# EAGLE design Prism (EAGLE 9.2.1)

## Sheet 1 of 3
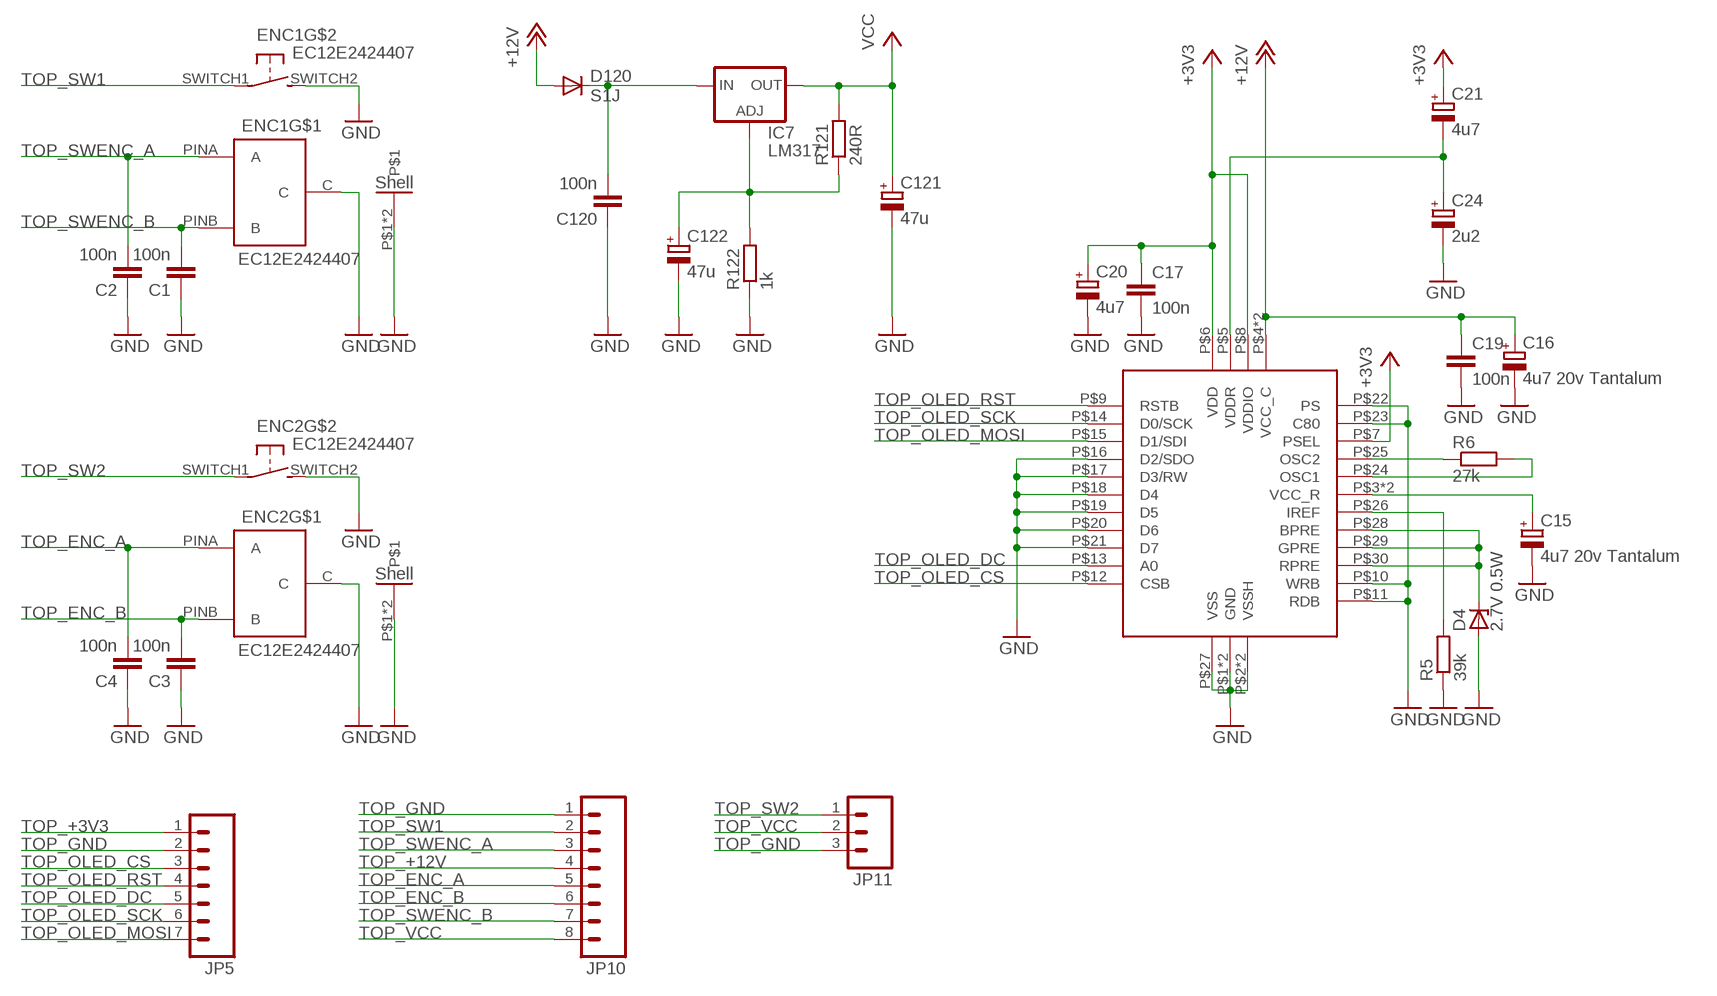
[diagram p0: schematic, sheet 1]

### Parts
C1  100n  C-EUC0603  [C0603]
C2  100n  C-EUC0603  [C0603]
C3  100n  C-EUC0603  [C0603]
C4  100n  C-EUC0603  [C0603]
C15  4u7 20v Tantalum  CPOL-EUCT3216  [CT3216]
C16  4u7 20v Tantalum  CPOL-EUCT3216  [CT3216]
C17  100n  C-EUC0603  [C0603]
C19  100n  C-EUC0603  [C0603]
C20  4u7  CPOL-EU153CLV-0405  [153CLV-0405]
C21  4u7  CPOL-EU153CLV-0405  [153CLV-0405]
C24  2u2  CPOL-EU153CLV-0405  [153CLV-0405]
C120  100n  C-EUC0603  [C0603]
C121  47u  CPOL-EU153CLV-0505  [CPOL-5]
C122  47u  CPOL-EU153CLV-0505  [CPOL-5]
D4  2.7V 0.5W  ZENER-DIODESOD80C  [SOD80C]
D120  S1J  DIODESMA  [SMA-DIODE]
ENC1  EC12E2424407  [EC12E2424407]
ENC2  EC12E2424407  [EC12E2424407]
IC7  LM317  LM317MDT  [DPACK]
JP5  M07  [1X07]
JP10  M081X08  [1X08]
JP11  M03PTH  [1X03]
R5  39k  R-EU_0603  [0603]
R6  27k  R-EU_0603  [0603]
R121  240R  R-EU_0603  [0603]
R122  1k  R-EU_0603  [0603]
U$1  MCOT096096AY  [MCOT096096AY]

### Nets
N$3: C120.2 D120.C IC7.3(IN)
N$9: C15.+ U$1.P$3(VCC_R) U$1.P$32(VCC_R)
N$16: C122.+ IC7.1(ADJ) R121.1 R122.2
N$23: C21.- C24.+ U$1.P$5(VDDR)
N$29: D4.C U$1.P$28(BPRE) U$1.P$29(GPRE) U$1.P$30(RPRE)
N$30: R6.1 U$1.P$25(OSC2)
N$31: R6.2 U$1.P$24(OSC1)
N$32: R5.2 U$1.P$26(IREF)
TOP_+3V3: C17.1 C20.+ C21.+ JP5.1 U$1.P$6(VDD) U$1.P$7(PSEL) U$1.P$8(VDDIO) ; supply symbol labelled +3V3
TOP_+12V: C16.+ C19.1 D120.A JP10.4 U$1.P$4(VCC_C) U$1.P$31(VCC_C) ; supply symbol labelled +12V
TOP_ENC_A: C4.2 ENC2.PINA(A) JP10.5
TOP_ENC_B: C3.2 ENC2.PINB(B) JP10.6
TOP_GND: C1.1 C2.1 C3.1 C4.1 C15.- C16.- C17.2 C19.2 C20.- C24.- C120.1 C121.- C122.- D4.A ENC1.C ENC1.P$1 ENC1.P$2 ENC1.SWITCH2(S) ENC2.C ENC2.P$1 ENC2.P$2 ENC2.SWITCH2(S) JP5.2 JP10.1 JP11.3 R5.1 R122.1 U$1.P$1(GND) U$1.P$2(VSSH) U$1.P$10(WRB) U$1.P$11(RDB) U$1.P$16(D2/SDO) U$1.P$17(D3/RW) U$1.P$18(D4) U$1.P$19(D5) U$1.P$20(D6) U$1.P$21(D7) U$1.P$22(PS) U$1.P$23(C80) U$1.P$27(VSS) U$1.P$33(VSSH) U$1.P$34(GND) ; supply symbol labelled GND
TOP_OLED_CS: JP5.3 U$1.P$12(CSB)
TOP_OLED_DC: JP5.5 U$1.P$13(A0)
TOP_OLED_MOSI: JP5.7 U$1.P$15(D1/SDI)
TOP_OLED_RST: JP5.4 U$1.P$9(RSTB)
TOP_OLED_SCK: JP5.6 U$1.P$14(D0/SCK)
TOP_SW1: ENC1.SWITCH1(P) JP10.2
TOP_SW2: ENC2.SWITCH1(P) JP11.1
TOP_SWENC_A: C2.2 ENC1.PINA(A) JP10.3
TOP_SWENC_B: C1.2 ENC1.PINB(B) JP10.7
TOP_VCC: C121.+ IC7.4(OUT) JP10.8 JP11.2 R121.2 ; supply symbol labelled VCC

## Sheet 2 of 3
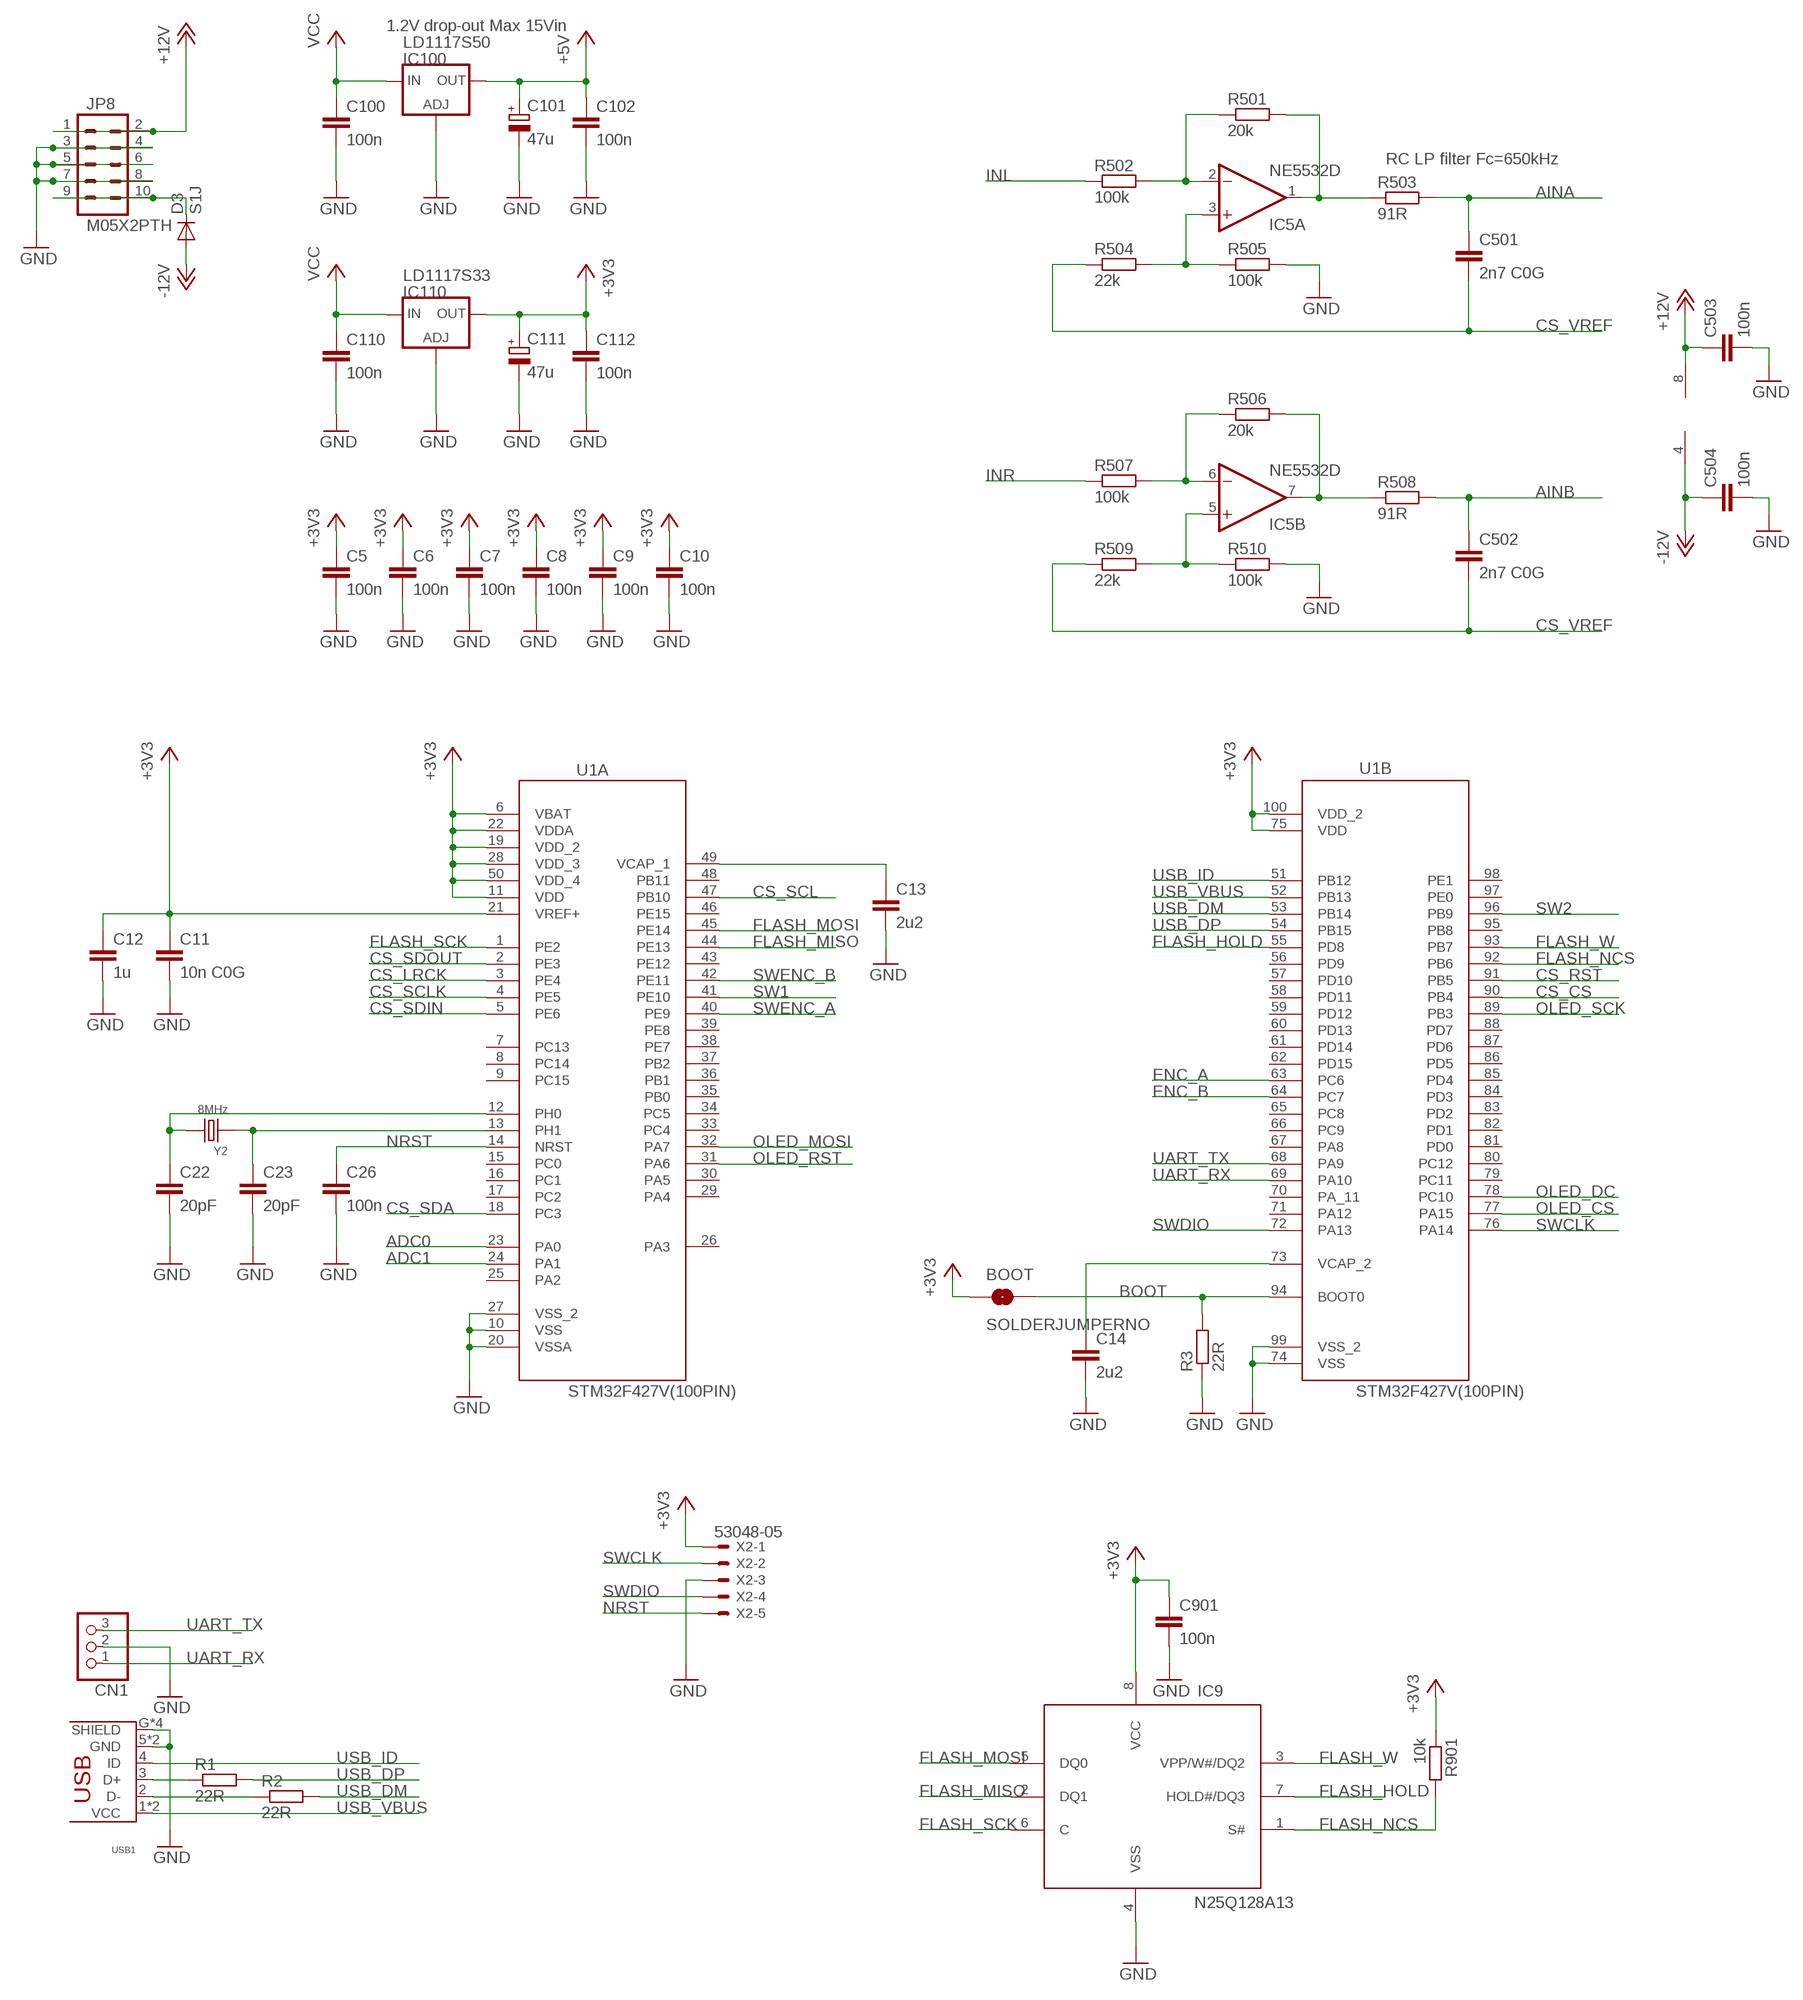
[diagram p1: schematic, sheet 2, part 1 of 2]
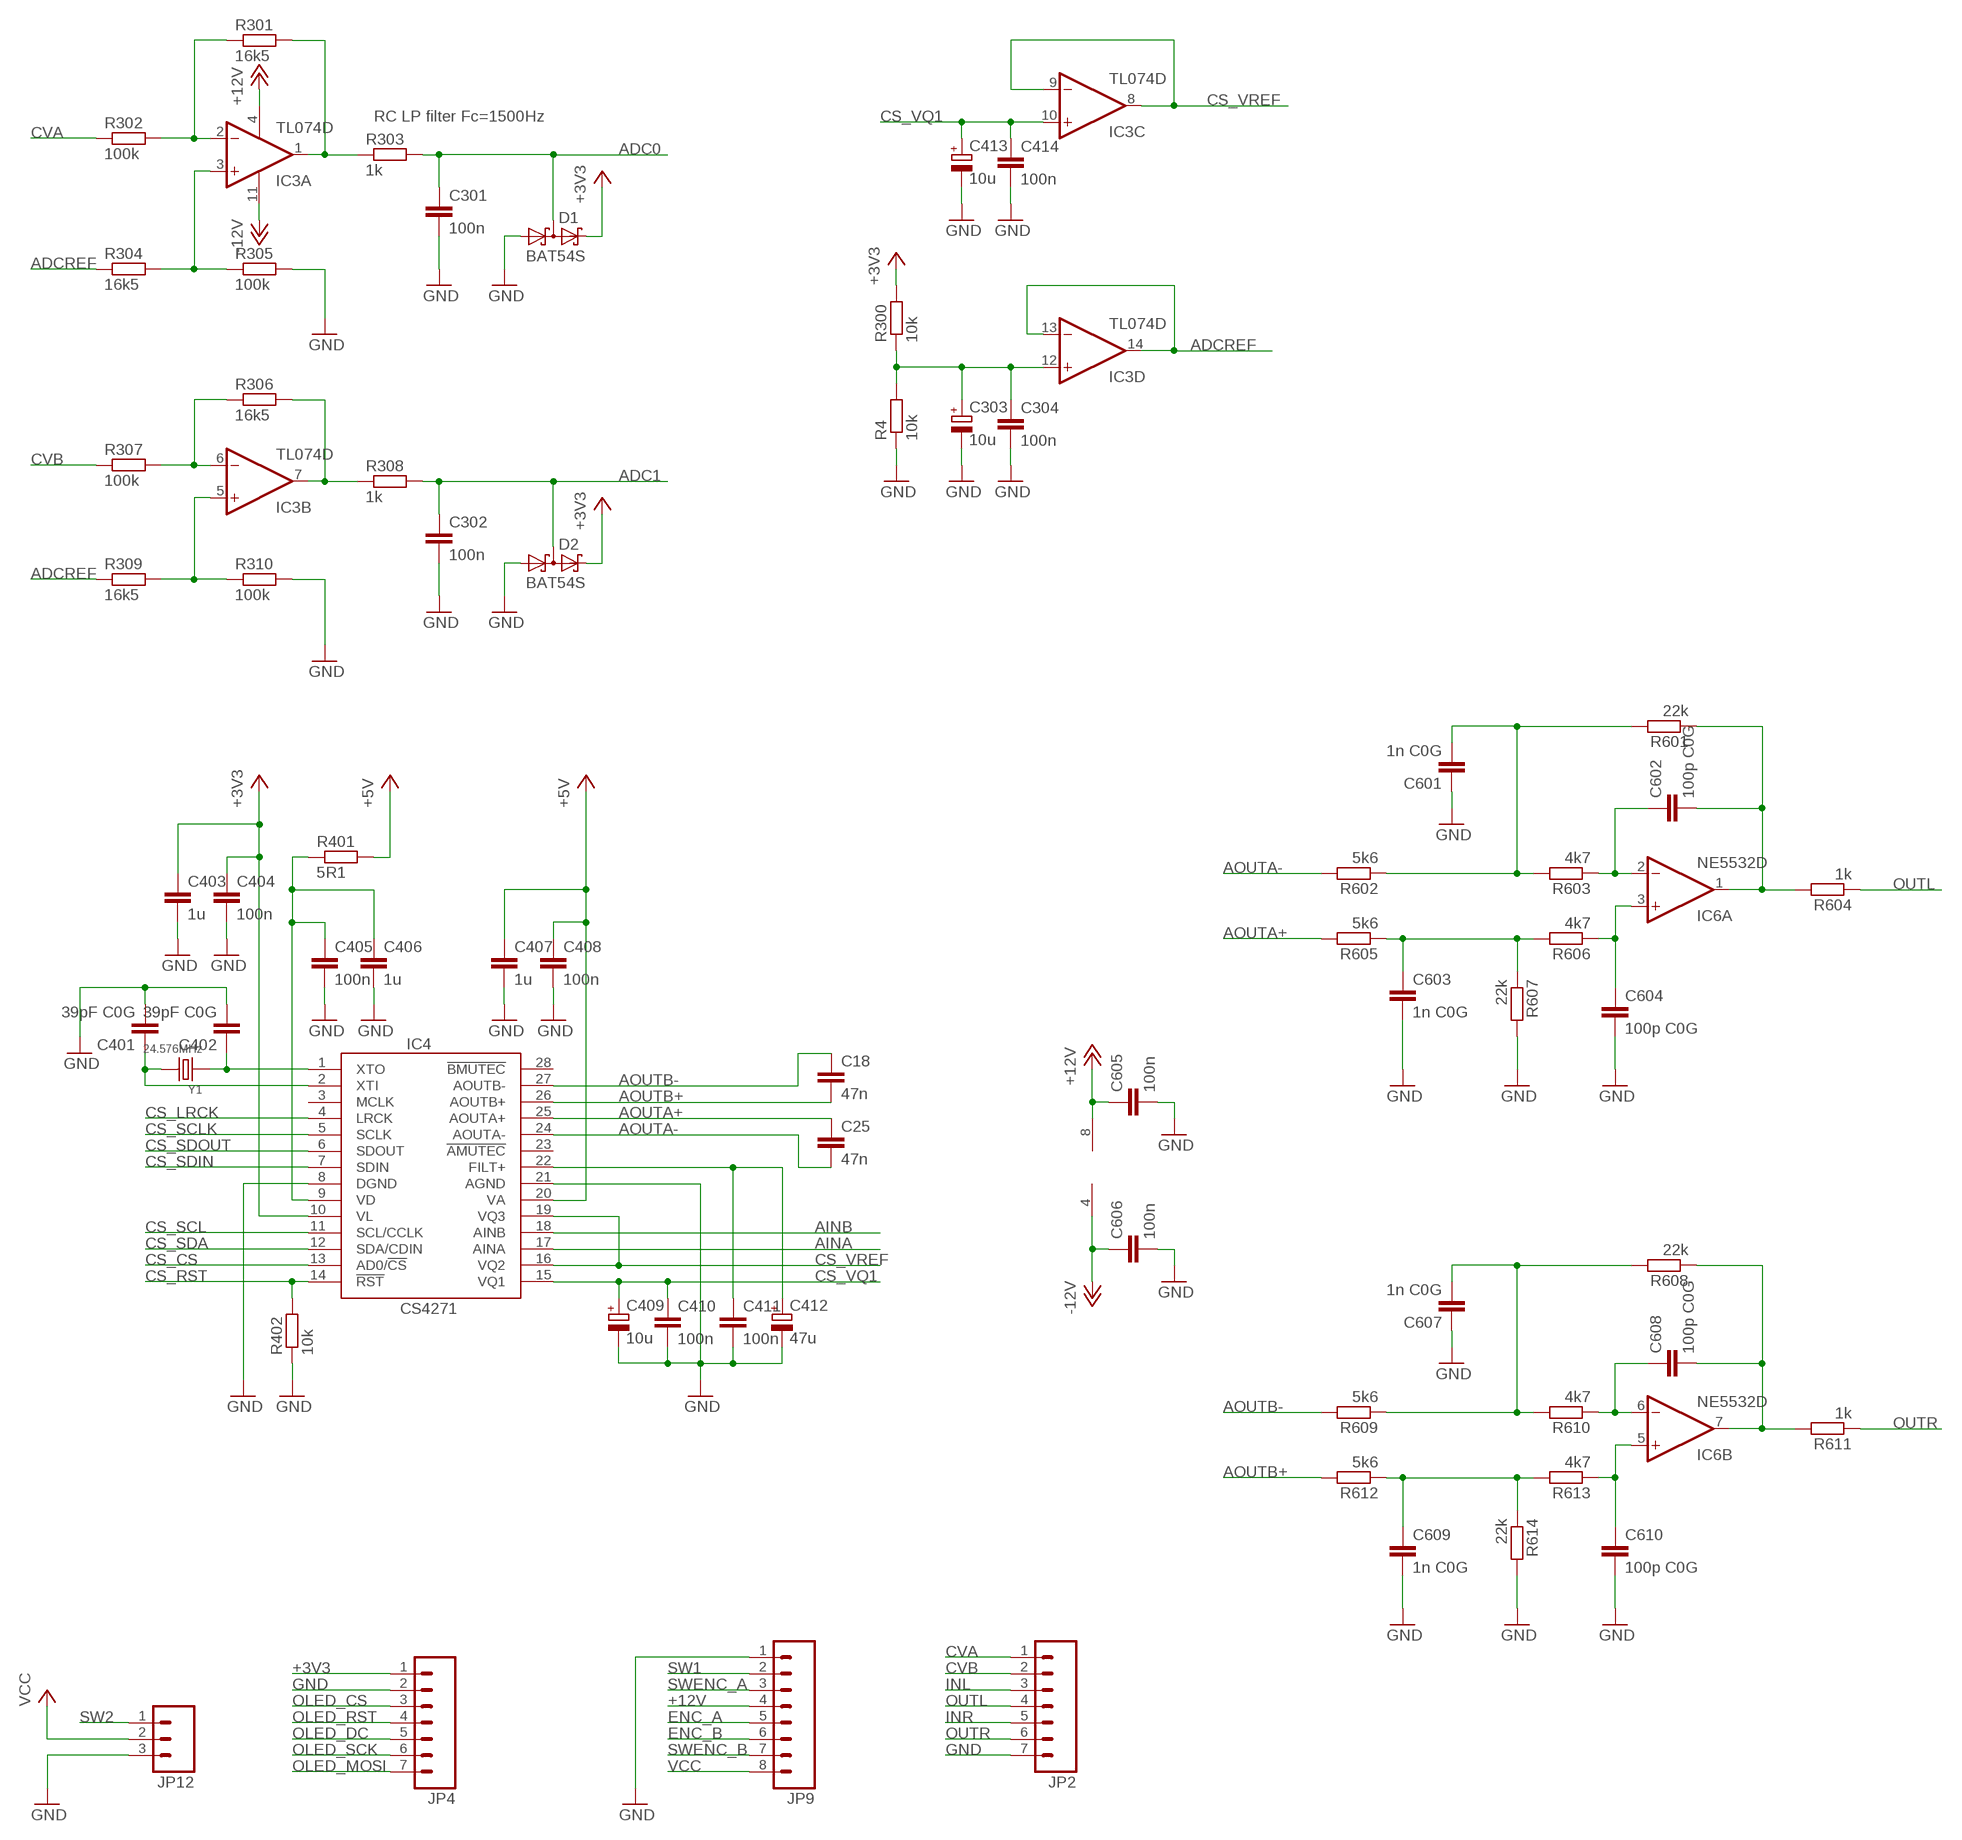
[diagram p2: schematic, sheet 2, part 2 of 2]

### Parts
BOOT  SOLDERJUMPERNO  [SJ_2S-NO]
C5  100n  C-EUC0603  [C0603]
C6  100n  C-EUC0603  [C0603]
C7  100n  C-EUC0603  [C0603]
C8  100n  C-EUC0603  [C0603]
C9  100n  C-EUC0603  [C0603]
C10  100n  C-EUC0603  [C0603]
C11  10n C0G  C-EUC0603  [C0603]
C12  1u  C-EUC0603  [C0603]
C13  2u2  C-EUC0603  [C0603]
C14  2u2  C-EUC0603  [C0603]
C18  47n  C-EUC0603  [C0603]
C22  20pF  C-EUC0603  [C0603]
C23  20pF  C-EUC0603  [C0603]
C25  47n  C-EUC0603  [C0603]
C26  100n  C-EUC0603  [C0603]
C100  100n  C-EUC0603  [C0603]
C101  47u  CPOL-EU153CLV-0505  [CPOL-5]
C102  100n  C-EUC0603  [C0603]
C110  100n  C-EUC0603  [C0603]
C111  47u  CPOL-EU153CLV-0505  [CPOL-5]
C112  100n  C-EUC0603  [C0603]
C301  100n  C-EUC0603  [C0603]
C302  100n  C-EUC0603  [C0603]
C303  10u  CPOL-EU153CLV-0505  [CPOL-5]
C304  100n  C-EUC0603  [C0603]
C401  39pF C0G  C-EUC0603  [C0603]
C402  39pF C0G  C-EUC0603  [C0603]
C403  1u  C-EUC0603  [C0603]
C404  100n  C-EUC0603  [C0603]
C405  100n  C-EUC0603  [C0603]
C406  1u  C-EUC0603  [C0603]
C407  1u  C-EUC0603  [C0603]
C408  100n  C-EUC0603  [C0603]
C409  10u  CPOL-EU153CLV-0505  [CPOL-5]
C410  100n  C-EUC0603  [C0603]
C411  100n  C-EUC0603  [C0603]
C412  47u  CPOL-EU153CLV-0505  [CPOL-5]
C413  10u  CPOL-EU153CLV-0505  [CPOL-5]
C414  100n  C-EUC0603  [C0603]
C501  2n7 C0G  C-EUC0603  [C0603]
C502  2n7 C0G  C-EUC0603  [C0603]
C503  100n  C-EUC0603  [C0603]
C504  100n  C-EUC0603  [C0603]
C601  1n C0G  C-EUC0603  [C0603]
C602  100p C0G  C-EUC0603  [C0603]
C603  1n C0G  C-EUC0603  [C0603]
C604  100p C0G  C-EUC0603  [C0603]
C605  100n  C-EUC0603  [C0603]
C606  100n  C-EUC0603  [C0603]
C607  1n C0G  C-EUC0603  [C0603]
C608  100p C0G  C-EUC0603  [C0603]
C609  1n C0G  C-EUC0603  [C0603]
C610  100p C0G  C-EUC0603  [C0603]
C901  100n  C-EUC0603  [C0603]
CN1  CON-JST-1X03PH-TH  [JST-B3B-PH-KL]
D1  BAT54S  [SOT23]
D2  BAT54S  [SOT23]
D3  S1J  DIODESMA  [SMA-DIODE]
IC3  TL074D  [SO14]
IC4  CS4271  [TSSOP28-0.65-9.7X4.4MM]
IC5  NE5532D  [SO08]
IC6  NE5532D  [SO08]
IC9  N25Q128A13  [SO8W]
IC100  LD1117S50  LD111750TRS  [SOT223]
IC110  LD1117S33  LD111750TRS  [SOT223]
JP2  M07  [1X07]
JP4  M07  [1X07]
JP8  M05X2PTH  [AVR_ICSP]
JP9  M081X08  [1X08]
JP12  M03PTH  [1X03]
R1  22R  R-EU_0603  [0603]
R2  22R  R-EU_0603  [0603]
R3  22R  R-EU_0603  [0603]
R4  10k  R-EU_0603  [0603]
R300  10k  R-EU_0603  [0603]
R301  16k5  R-EU_0603  [0603]
R302  100k  R-EU_0603  [0603]
R303  1k  R-EU_0603  [0603]
R304  16k5  R-EU_0603  [0603]
R305  100k  R-EU_0603  [0603]
R306  16k5  R-EU_0603  [0603]
R307  100k  R-EU_0603  [0603]
R308  1k  R-EU_0603  [0603]
R309  16k5  R-EU_0603  [0603]
R310  100k  R-EU_0603  [0603]
R401  5R1  R-EU_0603  [0603]
R402  10k  R-EU_0603  [0603]
R501  20k  R-EU_0603  [0603]
R502  100k  R-EU_0603  [0603]
R503  91R  R-EU_0603  [0603]
R504  22k  R-EU_0603  [0603]
R505  100k  R-EU_0603  [0603]
R506  20k  R-EU_0603  [0603]
R507  100k  R-EU_0603  [0603]
R508  91R  R-EU_0603  [0603]
R509  22k  R-EU_0603  [0603]
R510  100k  R-EU_0603  [0603]
R601  22k  R-EU_0603  [0603]
R602  5k6  R-EU_0603  [0603]
R603  4k7  R-EU_0603  [0603]
R604  1k  R-EU_0603  [0603]
R605  5k6  R-EU_0603  [0603]
R606  4k7  R-EU_0603  [0603]
R607  22k  R-EU_0603  [0603]
R608  22k  R-EU_0603  [0603]
R609  5k6  R-EU_0603  [0603]
R610  4k7  R-EU_0603  [0603]
R611  1k  R-EU_0603  [0603]
R612  5k6  R-EU_0603  [0603]
R613  4k7  R-EU_0603  [0603]
R614  22k  R-EU_0603  [0603]
R901  10k  R-EU_0603  [0603]
U1  STM32F427V(100PIN)  STM32F42XV/43XV(100PIN)  [QFP50P1600X1600X160-100N]
USB1  USB_HRS_ZX62-B-5PA(11)MICRO.B-  [HRS_ZX62D-AB-5P8_USB]
X2  53048-05  [53048-05]
Y1  24.576MHz  SMD-CRYSTAL-8MHZ-20PF-20PPM(2P-5.0X3.2MM)  [X2-SMD-5.0X3.2X1.3MM]
Y2  8MHz  SMD-CRYSTAL-8MHZ-20PF-20PPM(2P-5.0X3.2MM)  [X2-SMD-5.0X3.2X1.3MM]

### Nets
+3V3: BOOT.1 C5.1 C6.1 C7.1 C8.1 C9.1 C10.1 C11.1 C12.1 C111.+ C112.1 C403.1 C404.1 C901.1 D1.2(C2) D2.2(C2) IC4.10(VL) IC9.8(VCC) IC110.2(OUT) IC110.4(OUT) JP4.1 R300.2 R901.1 U1.6(A:VBAT) U1.11(A:VDD) U1.19(A:VDD_2) U1.21(A:VREF+) U1.22(A:VDDA) U1.28(A:VDD_3) U1.50(A:VDD_4) U1.75(B:VDD) U1.100(B:VDD_2) X2.1
+5V: C101.+ C102.1 C407.1 C408.1 IC4.20(VA) IC100.2(OUT) IC100.4(OUT) R401.2
+12V: C503.1 C605.1 IC3.4(P:V+) IC5.8(P:V+) IC6.8(P:V+) JP8.1 JP8.2 JP9.4
-12V: C504.1 C606.1 D3.A IC3.11(P:V-) IC5.4(P:V-) IC6.4(P:V-)
ADC0: C301.1 D1.3(C1A2) R303.2 U1.23(A:PA0)
ADC1: C302.1 D2.3(C1A2) R308.2 U1.24(A:PA1)
ADCREF: IC3.13(D:-IN) IC3.14(D:OUT) R304.1 R309.1
AINA: C501.1 IC4.17(AINA) R503.2
AINB: C502.1 IC4.18(AINB) R508.2
ANALOG_OUTA: C602.2 IC6.1(A:OUT) R601.1 R604.2
ANALOG_OUTB: C608.2 IC6.7(B:OUT) R608.1 R611.2
AOUTA+: C25.1 IC4.25(AOUTA+) R605.2
AOUTA-: C25.2 IC4.24(AOUTA-) R602.2
AOUTB+: C18.2 IC4.26(AOUTB+) R612.2
AOUTB-: C18.1 IC4.27(AOUTB-) R609.2
BOOT: BOOT.2 R3.2 U1.94(B:BOOT0)
CS_CS: IC4.13(AD0/!CS) U1.90(B:PB4)
CS_LRCK: IC4.4(LRCK) U1.3(A:PE4)
CS_RST: IC4.14(!RST) R402.2 U1.91(B:PB5)
CS_SCL: IC4.11(SCL/CCLK) U1.47(A:PB10)
CS_SCLK: IC4.5(SCLK) U1.4(A:PE5)
CS_SDA: IC4.12(SDA/CDIN) U1.18(A:PC3)
CS_SDIN: IC4.7(SDIN) U1.5(A:PE6)
CS_SDOUT: IC4.6(SDOUT) U1.2(A:PE3)
CS_VQ1: C409.+ C410.1 C413.+ C414.1 IC3.10(C:+IN) IC4.15(VQ1)
CS_VREF: C501.2 C502.2 IC3.8(C:OUT) IC3.9(C:-IN) IC4.16(VQ2) IC4.19(VQ3) R504.1 R509.1
CVA: JP2.1 R302.1
CVB: JP2.2 R307.1
ENC_A: JP9.5 U1.63(B:PC6)
ENC_B: JP9.6 U1.64(B:PC7)
FLASH_HOLD: IC9.7(HOLD#/DQ3) U1.55(B:PD8)
FLASH_MISO: IC9.2(DQ1) U1.44(A:PE13)
FLASH_MOSI: IC9.5(DQ0) U1.45(A:PE14)
FLASH_NCS: IC9.1(S#) R901.2 U1.92(B:PB6)
FLASH_SCK: IC9.6(C) U1.1(A:PE2)
FLASH_W: IC9.3(VPP/W#/DQ2) U1.93(B:PB7)
GND: C5.2 C6.2 C7.2 C8.2 C9.2 C10.2 C11.2 C12.2 C13.2 C14.2 C22.2 C23.2 C26.2 C100.2 C101.- C102.2 C110.2 C111.- C112.2 C301.2 C302.2 C303.- C304.2 C401.2 C402.2 C403.2 C404.2 C405.2 C406.2 C407.2 C408.2 C409.- C410.2 C411.2 C412.- C413.- C414.2 C503.2 C504.2 C601.1 C603.2 C604.2 C605.2 C606.2 C607.1 C609.2 C610.2 C901.2 CN1.2 D1.1(A1) D2.1(A1) IC4.8(DGND) IC4.21(AGND) IC9.4(VSS) IC100.1(ADJ) IC110.1(ADJ) JP2.7 JP4.2 JP8.3 JP8.4 JP8.5 JP8.6 JP8.7 JP8.8 JP9.1 JP12.3 R3.1 R4.1 R305.2 R310.2 R402.1 R505.2 R510.2 R607.2 R614.2 U1.10(A:VSS) U1.20(A:VSSA) U1.27(A:VSS_2) U1.74(B:VSS) U1.99(B:VSS_2) USB1.5(GND) USB1.7(GND) USB1.G2(SHIELD) USB1.G3(SHIELD) USB1.G4(SHIELD) USB1.G(SHIELD) X2.3
INL: JP2.3 R502.1
INR: JP2.5 R507.1
N$1: C603.1 R605.1 R606.2 R607.1
N$2: IC3.3(A:+IN) R304.2 R305.1
N$4: IC3.2(A:-IN) R301.1 R302.2
N$5: IC3.1(A:OUT) R301.2 R303.1
N$7: D3.C JP8.9 JP8.10
N$10: C601.2 R601.2 R602.1 R603.2
N$11: C13.1 U1.49(A:VCAP_1)
N$12: C23.1 U1.13(A:PH1) Y2.1
N$13: C602.1 IC6.2(A:-IN) R603.1
N$14: C604.1 IC6.3(A:+IN) R606.1
N$15: C22.1 U1.12(A:PH0) Y2.2
N$17: C14.1 U1.73(B:VCAP_2)
N$18: C402.1 IC4.1(XTO) Y1.1
N$19: R1.1 USB1.3(D+)
N$20: C411.1 C412.+ IC4.22(FILT+)
N$21: C401.1 IC4.2(XTI) Y1.2
N$22: R2.1 USB1.2(D-)
N$25: C609.1 R612.1 R613.2 R614.1
N$26: C607.2 R608.2 R609.1 R610.2
N$27: C608.1 IC6.6(B:-IN) R610.1
N$28: C610.1 IC6.5(B:+IN) R613.1
N$36: IC5.3(A:+IN) R504.2 R505.1
N$38: IC5.2(A:-IN) R501.1 R502.2
N$40: IC5.1(A:OUT) R501.2 R503.1
N$42: IC5.5(B:+IN) R509.2 R510.1
N$43: IC5.6(B:-IN) R506.1 R507.2
N$45: IC5.7(B:OUT) R506.2 R508.1
N$48: C303.+ C304.1 IC3.12(D:+IN) R4.2 R300.1
N$49: IC3.5(B:+IN) R309.2 R310.1
N$50: IC3.6(B:-IN) R306.1 R307.2
N$52: IC3.7(B:OUT) R306.2 R308.1
NRST: C26.1 U1.14(A:NRST) X2.5
OLED_CS: JP4.3 U1.77(B:PA15)
OLED_DC: JP4.5 U1.78(B:PC10)
OLED_MOSI: JP4.7 U1.32(A:PA7)
OLED_RST: JP4.4 U1.31(A:PA6)
OLED_SCK: JP4.6 U1.89(B:PB3)
OUTL: JP2.4 R604.1
OUTR: JP2.6 R611.1
SW1: JP9.2 U1.41(A:PE10)
SW2: JP12.1 U1.96(B:PB9)
SWCLK: U1.76(B:PA14) X2.2
SWDIO: U1.72(B:PA13) X2.4
SWENC_A: JP9.3 U1.40(A:PE9)
SWENC_B: JP9.7 U1.42(A:PE11)
UART_RX: CN1.1 U1.69(B:PA10)
UART_TX: CN1.3 U1.68(B:PA9)
USB_DM: R2.2 U1.53(B:PB14)
USB_DP: R1.2 U1.54(B:PB15)
USB_ID: U1.51(B:PB12) USB1.4(ID)
USB_VBUS: U1.52(B:PB13) USB1.1(VCC) USB1.6(VCC)
VCC: C100.1 C110.1 IC100.3(IN) IC110.3(IN) JP9.8 JP12.2
VD: C405.1 C406.1 IC4.9(VD) R401.1
Unconnected: IC4.3(MCLK) IC4.23(!AMUTEC) IC4.28(!BMUTEC) U1.7(A:PC13) U1.8(A:PC14) U1.9(A:PC15) U1.15(A:PC0) U1.16(A:PC1) U1.17(A:PC2) U1.25(A:PA2) U1.26(A:PA3) U1.29(A:PA4) U1.30(A:PA5) U1.33(A:PC4) U1.34(A:PC5) U1.35(A:PB0) U1.36(A:PB1) U1.37(A:PB2) U1.38(A:PE7) U1.39(A:PE8) U1.43(A:PE12) U1.46(A:PE15) U1.48(A:PB11) U1.56(B:PD9) U1.57(B:PD10) U1.58(B:PD11) U1.59(B:PD12) U1.60(B:PD13) U1.61(B:PD14) U1.62(B:PD15) U1.65(B:PC8) U1.66(B:PC9) U1.67(B:PA8) U1.70(B:PA_11) U1.71(B:PA12) U1.79(B:PC11) U1.80(B:PC12) U1.81(B:PD0) U1.82(B:PD1) U1.83(B:PD2) U1.84(B:PD3) U1.85(B:PD4) U1.86(B:PD5) U1.87(B:PD6) U1.88(B:PD7) U1.95(B:PB8) U1.97(B:PE0) U1.98(B:PE1)

### Notes on the sheet
- 1.2V drop-out Max 15Vin
- RC LP filter Fc=1500Hz
- RC LP filter Fc=650kHz

## Sheet 3 of 3
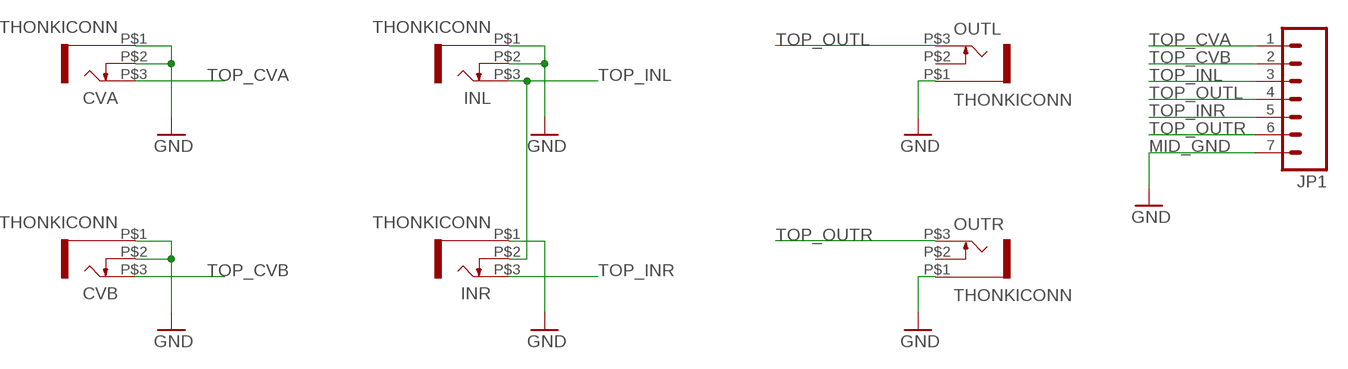
[diagram p3: schematic, sheet 3]

### Parts
CVA  THONKICONN  [THONKICONN]
CVB  THONKICONN  [THONKICONN]
INL  THONKICONN  [THONKICONN]
INR  THONKICONN  [THONKICONN]
JP1  M07  [1X07]
OUTL  THONKICONN  [THONKICONN]
OUTR  THONKICONN  [THONKICONN]

### Nets
MID_GND: CVA.P$1 CVA.P$2 CVB.P$1 CVB.P$2 INL.P$1 INL.P$2 INR.P$1 JP1.7 OUTL.P$1 OUTR.P$1 ; supply symbol labelled GND
TOP_CVA: CVA.P$3 JP1.1
TOP_CVB: CVB.P$3 JP1.2
TOP_INL: INL.P$3 INR.P$2 JP1.3
TOP_INR: INR.P$3 JP1.5
TOP_OUTL: JP1.4 OUTL.P$3
TOP_OUTR: JP1.6 OUTR.P$3
Unconnected: OUTL.P$2 OUTR.P$2

## Library data of the parts
BOOT = SparkFun:SOLDERJUMPER: Solder Jumper Standard SMD solder jumper. Used to automate production. Two varients : Normally Open and Normally Closed are the same, but have different paste layers. NC will have a large amount of paste and should jumper during reflow.
C1-C14 C17-C19 C22 C23 C25 C26 C100 C102 C110 C112 C120 C301 C302 C304 C401-C408 C410 C411 C414 C501-C504 C601-C610 C901 = Rebel:C-EU: CAPACITOR, European symbol
C15 C16 C20 C21 C24 C101 C111 C121 C122 C303 C409 C412 C413 = Rebel:CPOL-EU: POLARIZED CAPACITOR, European symbol
CN1 = Rebel:CON-JST-1X03
CVA CVB INL INR OUTL OUTR = Rebel:THONKICONN
D1 D2 = diode:BAT54S: Schottky Diodes Pin connection corrected 2011-05-04 Source: Fairchild .. BAT54.pdf
D3 D120 = SparkFun:DIODE: Diode These are standard reverse protection diodes and small signal diodes. SMA package can handle up to about 1A. SOD-323 can handle about 200mA. What the SOD-323 package when ordering, there are some mfgs out there that are 5-pin packages.
D4 = diode:ZENER-DIODE: Z-Diode
ENC1 ENC2 = Rebel:EC12E2424407: rotary encoder with switch EC12E2424407
IC3 = linear:TL074: OP AMP
IC4 = Rebel:CS4271
IC5 IC6 = linear:NE5532: AUDIO AMPLIFIER
IC7 = v-reg:LM317?*: 500 mA Adjustable Output Positive Voltage Regulator Source: http://www.onsemi.co.jp .. LM317M-D.PDF
IC9 = Rebel:N25Q128A13: N25Q128A13 Flash Memory SO8W
IC100 IC110 = 4ms-main-parts:LD1117: Low drop fixed and adjustable positive voltage regulators 1 A Source: http://www.st.com/stonline/products/literature/ds/7194/ld1117axx.pdf
JP1 JP2 JP4 JP5 = SparkFun:M07: Header 7 Standard 7-pin 0.1" header. Use with straight break away headers (SKU : PRT-00116), right angle break away headers (PRT-00553), swiss pins (PRT-00743), machine pins (PRT-00117), and female headers (PRT-00115). NOTES ON THE VARIANTS LOCK and LOCK_LONGPADS... This footprint was designed to help hold the alignment of a through-hole component (i.e. 7-pin header) while soldering it into place. You may notice that each hole has been shifted either up or down by 0.005 of an inch from it's more standard position (which is usually a perfectly straight line). This slight alteration caused the pins (the squares in the middle) to touch the edges of the holes. Because they are alternating, it causes a "brace" to hold the header in place. 0.005 has proven to be the perfect amount of "off-center" position when using our standard breakaway headers. Although looks a little odd when you look at the bare footprint, once you have a header in there, the alteration is very hard to notice. Also, if you push a header all the way into place, it is covered up entirely on the bottom side. This idea of altering the position of holes to aid alignment will be further integrated into the Sparkfun Library for other footprints. It can help hold any component with 3 or more connection pins.
JP8 = SparkFun:M05X2: Header 5x2 Standard 10-pin dual row 0.1" header. Commonly used with AVR-ISP. Use with Spark Fun Electronics SKU: PRT-00778
JP9 JP10 = SparkFun:M08: Header 8 Standard 8-pin 0.1" header. Use with straight break away headers (SKU : PRT-00116), right angle break away headers (PRT-00553), swiss pins (PRT-00743), machine pins (PRT-00117), and female headers (PRT-00115).
JP11 JP12 = SparkFun:M03: Header 3 Standard 3-pin 0.1" header. Use with straight break away headers (SKU : PRT-00116), right angle break away headers (PRT-00553), swiss pins (PRT-00743), machine pins (PRT-00117), and female headers (PRT-00115). Molex polarized connector foot print use with SKU : PRT-08232 with associated crimp pins and housings.
R1-R6 R121 R122 R300-R310 R401 R402 R501-R510 R601-R614 R901 = Rebel:R-EU_: RESISTOR, European symbol
U1 = Rebel:STM32F42XV/43XV(100PIN): STM32F746VGT6
U$1 = Rebel:MCOT096096AY
USB1 = Rebel:USB_HRS_ZX62-B-5PA(11)MICRO.B
X2 = con-molex:53?-05: CONNECTOR wire to board 1.25 mm (.049 inch) pitch header; MF: MOLEX; MPN: 53048-0510; OC_FARNELL: 9732926; OC_NEWARK: 57H4722
Y1 Y2 = Seeed-OPL-crystal-osctllator:SMD-CRYSTAL-8MHZ-20PF-20PPM(2P-5.0X3.2MM): 306010004; MPN: 5032/2P; VALUE: 5032/2p

## Net classes
1 power: width 0.178 mm, drill 0.305 mm, clearance 0.178 mm to class 0, clearance 0.178 mm

## Board
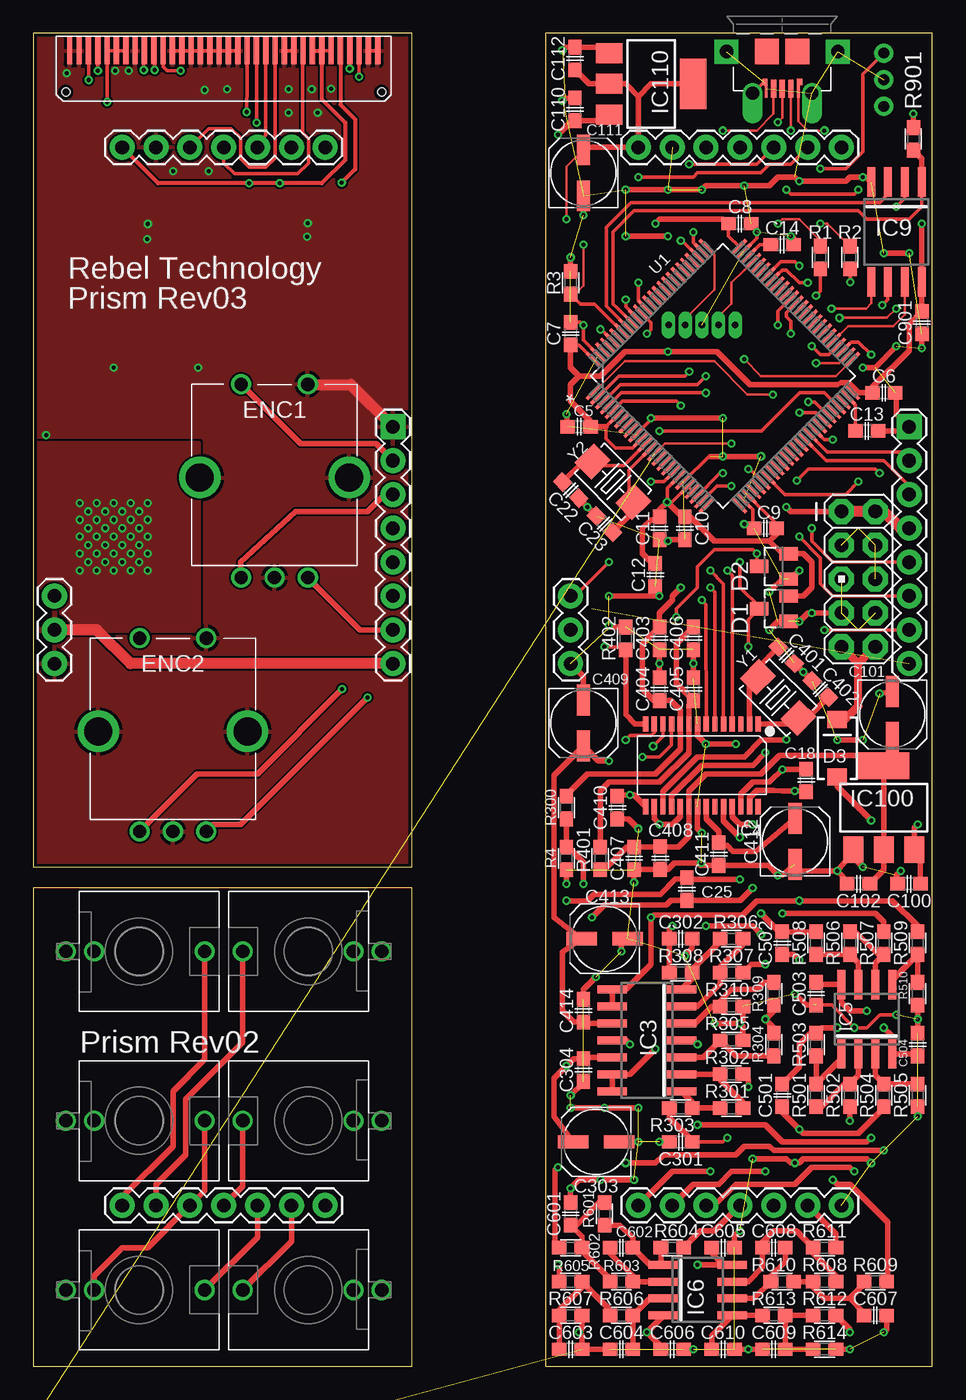
[diagram p4: board, top side]
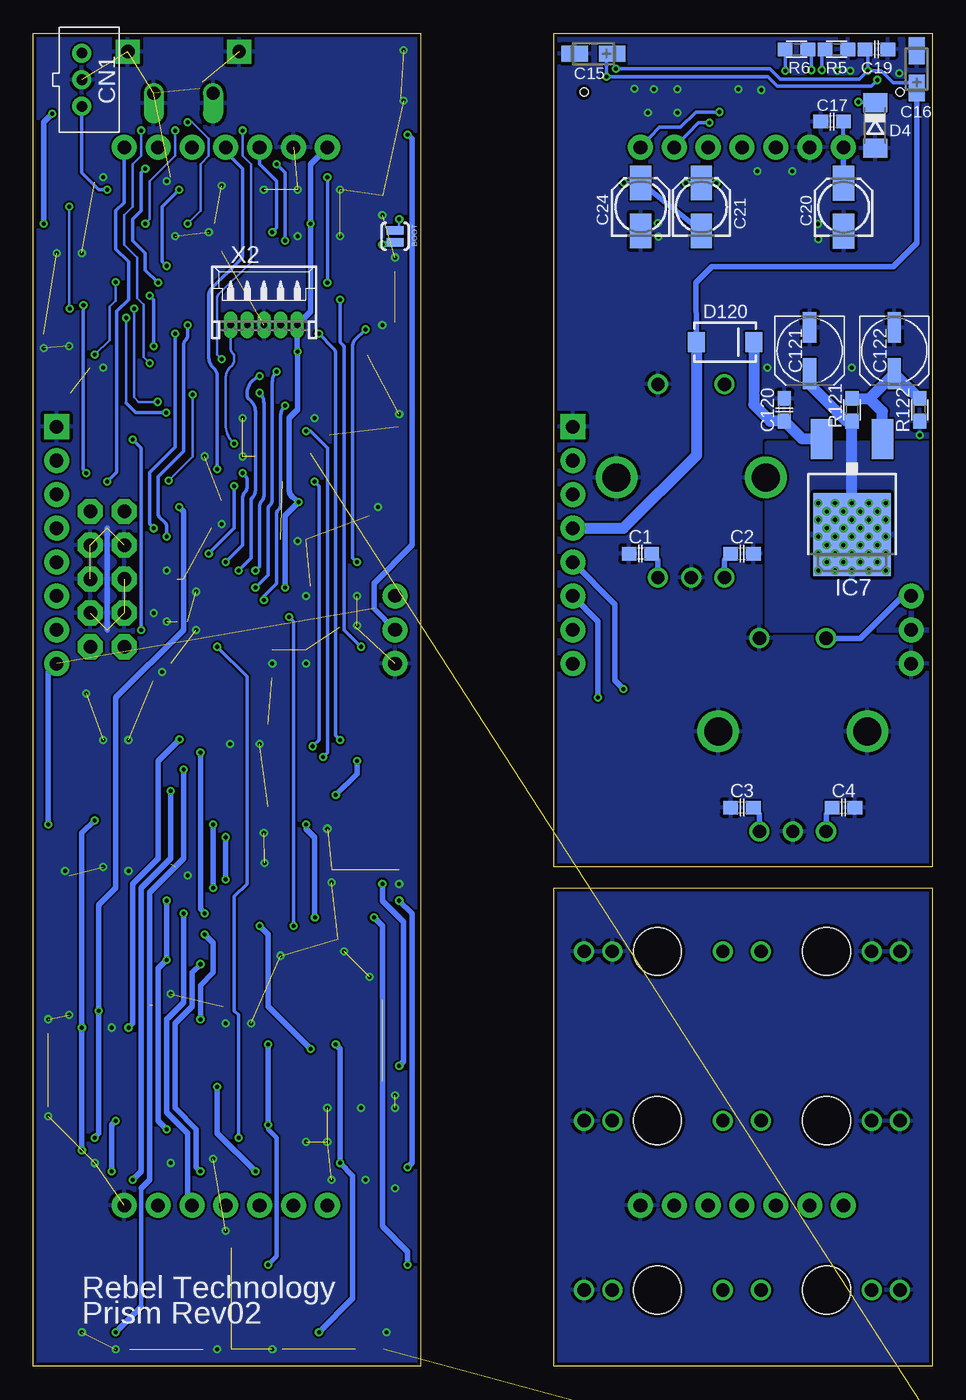
[diagram p5: board, bottom side, seen from below]

Size 67.47 x 100 mm. Coordinates in mm from the lower left corner, seen from the top.
Outline: 38.42,0 67.47,0 67.47,100 38.42,100 38.42,0
Outline: 28.41,35.87 0,35.87 0,0 28.41,0 28.41,35.87
Outline: 0,37.47 28.41,37.47 28.41,100 0,100 0,37.47
Copper layers (1*16): Top 0.035mm / dielectric 1.5mm / Bottom 0.035mm
Design rules "SeeedStudio_2layer_DRU_no_angle_20140221": minimum track width 6mil, minimum drill 12mil, track to track 6mil, track to pad 6mil, pad to pad 6mil, via to via 6mil, smd to smd 0mil, copper to edge 10mil, drill to drill 10mil, minimum pad ring 10mil, minimum via ring 6mil, stop-mask expansion 2mil, vias tented up to drill 100mil, thermal gap 10mil

### Footprints (pad centres in the part's own frame; a part is rotated, then mirrored left to right if it is on the bottom)
SJ_2S-NO = smd 0.635 x 1.27: 1 -0.45,0; 2 0.45,0
C0603 = smd 1.1 x 1: 1 -0.85,0; 2 0.85,0
CT3216 = smd 2 x 1.2: + -1.4,0; - 1.4,0
153CLV-0405 = smd 2.6 x 1.6: + 1.8,0; - -1.8,0
CPOL-5 = smd 2.3 x 1: + 1.725,0; - -1.725,0
JST-B3B-PH-KL = drill 0.8 pad 1.422: 1 2,0; 2 0,0; 3 -2,0
THONKICONN = drill 1: P$1 0,-5.5; P$2 0,-3.38; P$3 0,4.92 | hole 3.6: 0,0
SOT23 = smd 1 x 1.4: 1 -0.95,-1.1; 2 0.95,-1.1; 3 0,1.1
SMA-DIODE = smd 1.27 x 1.47: A -2.15,0; C 2.15,0
SOD80C = smd 1.4 x 1.8: A 1.7,0; C -1.7,0
EC12E2424407 = drill 1: C 0,-7.5; PINA -2.5,-7.5; PINB 2.5,-7.5; SWITCH1 -2.5,7; SWITCH2 2.5,7 | drill 2.1: P$1 -5.6,0; P$2 5.6,0
SO14 = smd 0.6 x 2.2: 1 -3.81,-2.6; 2 -2.54,-2.6; 3 -1.27,-2.6; 4 0,-2.6; 5 1.27,-2.6; 6 2.54,-2.6; 7 3.81,-2.6; 8 3.81,2.6; 9 2.54,2.6; 10 1.27,2.6; 11 0,2.6; 12 -1.27,2.6; 13 -2.54,2.6; 14 -3.81,2.6
TSSOP28-0.65-9.7X4.4MM = smd 0.4 x 1.15: 1 -4.225,-3.1; 2 -3.575,-3.1; 3 -2.925,-3.1; 4 -2.275,-3.1; 5 -1.625,-3.1; 6 -0.975,-3.1; 7 -0.325,-3.1; 8 0.325,-3.1; 9 0.975,-3.1; 10 1.625,-3.1; 11 2.275,-3.1; 12 2.925,-3.1; 13 3.575,-3.1; 14 4.225,-3.1; 15 4.225,3.1; 16 3.575,3.1; 17 2.925,3.1; 18 2.275,3.1; 19 1.625,3.1; 20 0.975,3.1; 21 0.325,3.1; 22 -0.325,3.1; 23 -0.975,3.1; 24 -1.625,3.1; 25 -2.275,3.1; 26 -2.925,3.1; 27 -3.575,3.1; 28 -4.225,3.1
SO08 = smd 0.6 x 2.2: 1 -1.905,-2.6; 2 -0.635,-2.6; 3 0.635,-2.6; 4 1.905,-2.6; 5 1.905,2.6; 6 0.635,2.6; 7 -0.635,2.6; 8 -1.905,2.6
DPACK = smd 1.6 x 3: 1 -2.28,-4.8; 3 2.28,-4.8 | smd 5.8 x 6.2: 4 0,2.38
SO8W = smd 0.6 x 2.2: 1 -1.905,-3.75; 2 -0.635,-3.75; 3 0.635,-3.75; 4 1.905,-3.75; 5 1.905,3.75; 6 0.635,3.75; 7 -0.635,3.75; 8 -1.905,3.75
SOT223 = smd 1.5 x 2: 1 -2.3,-3.15; 2 0,-3.15; 3 2.3,-3.15 | smd 3.8 x 2: 4 0,3.15
1X07 = drill 1.016 pad 1.88: 1 0,0; 2 2.54,0; 3 5.08,0; 4 7.62,0; 5 10.16,0; 6 12.7,0; 7 15.24,0
AVR_ICSP = drill 1.016 pad 1.88 octagon: 1 -1.27,5.08; 2 1.27,5.08; 3 -1.27,2.54; 4 1.27,2.54; 5 -1.27,0; 6 1.27,0; 7 -1.27,-2.54; 8 1.27,-2.54; 9 -1.27,-5.08; 10 1.27,-5.08
1X08 = drill 1.016 pad 1.88 square: 1 0,0 | drill 1.016 pad 1.88: 2 2.54,0; 3 5.08,0; 4 7.62,0; 5 10.16,0; 6 12.7,0; 7 15.24,0; 8 17.78,0
1X03 = drill 1.016 pad 1.88: 1 0,0; 2 2.54,0; 3 5.08,0
0603 = smd 1.1 x 1: 1 -0.85,0; 2 0.85,0
QFP50P1600X1600X160-100N = smd 1.473 x 0.254: 1 -7.722,5.994; 2 -7.722,5.512; 3 -7.722,5.004; 4 -7.722,4.496; 5 -7.722,3.988; 6 -7.722,3.505; 7 -7.722,2.997; 8 -7.722,2.489; 9 -7.722,2.007; 10 -7.722,1.499; 11 -7.722,0.991; 12 -7.722,0.508; 13 -7.722,0; 14 -7.722,-0.508; 15 -7.722,-0.991; 16 -7.722,-1.499; 17 -7.722,-2.007; 18 -7.722,-2.489; 19 -7.722,-2.997; 20 -7.722,-3.505; 21 -7.722,-3.988; 22 -7.722,-4.496; 23 -7.722,-5.004; 24 -7.722,-5.512; 25 -7.722,-5.994; 51 7.722,-5.994; 52 7.722,-5.512; 53 7.722,-5.004; 54 7.722,-4.496; 55 7.722,-3.988; 56 7.722,-3.505; 57 7.722,-2.997; 58 7.722,-2.489; 59 7.722,-2.007; 60 7.722,-1.499; 61 7.722,-0.991; 62 7.722,-0.508; 63 7.722,0; 64 7.722,0.508; 65 7.722,0.991; 66 7.722,1.499; 67 7.722,2.007; 68 7.722,2.489; 69 7.722,2.997; 70 7.722,3.505; 71 7.722,3.988; 72 7.722,4.496; 73 7.722,5.004; 74 7.722,5.512; 75 7.722,5.994 | smd 0.254 x 1.473: 26 -5.994,-7.722; 27 -5.512,-7.722; 28 -5.004,-7.722; 29 -4.496,-7.722; 30 -3.988,-7.722; 31 -3.505,-7.722; 32 -2.997,-7.722; 33 -2.489,-7.722; 34 -2.007,-7.722; 35 -1.499,-7.722; 36 -0.991,-7.722; 37 -0.508,-7.722; 38 0,-7.722; 39 0.508,-7.722; 40 0.991,-7.722; 41 1.499,-7.722; 42 2.007,-7.722; 43 2.489,-7.722; 44 2.997,-7.722; 45 3.505,-7.722; 46 3.988,-7.722; 47 4.496,-7.722; 48 5.004,-7.722; 49 5.512,-7.722; 50 5.994,-7.722; 76 5.994,7.722; 77 5.512,7.722; 78 5.004,7.722; 79 4.496,7.722; 80 3.988,7.722; 81 3.505,7.722; 82 2.997,7.722; 83 2.489,7.722; 84 2.007,7.722; 85 1.499,7.722; 86 0.991,7.722; 87 0.508,7.722; 88 0,7.722; 89 -0.508,7.722; 90 -0.991,7.722; 91 -1.499,7.722; 92 -2.007,7.722; 93 -2.489,7.722; 94 -2.997,7.722; 95 -3.505,7.722; 96 -3.988,7.722; 97 -4.496,7.722; 98 -5.004,7.722; 99 -5.512,7.722; 100 -5.994,7.722
MCOT096096AY = smd 0.4 x 2: P$1 -11.55,-2; P$2 -10.85,-2; P$3 -10.15,-2; P$4 -9.45,-2; P$5 -8.75,-2; P$6 -8.05,-2; P$7 -7.35,-2; P$8 -6.65,-2; P$9 -5.95,-2; P$10 -5.25,-2; P$11 -4.55,-2; P$12 -3.85,-2; P$13 -3.15,-2; P$14 -2.45,-2; P$15 -1.75,-2; P$16 -1.05,-2; P$17 -0.35,-2; P$18 0.35,-2; P$19 1.05,-2; P$20 1.75,-2; P$21 2.45,-2; P$22 3.15,-2; P$23 3.85,-2; P$24 4.55,-2; P$25 5.25,-2; P$26 5.95,-2; P$27 6.65,-2; P$28 7.35,-2; P$29 8.05,-2; P$30 8.75,-2; P$31 9.45,-2; P$32 10.15,-2; P$33 10.85,-2; P$34 11.55,-2 | hole 0.6: 11.85,1.1; -11.85,1.1
HRS_ZX62D-AB-5P8_USB = smd 0.4 x 0.5: 1 -1.3,2.4; 5 1.3,2.4 | smd 0.4 x 1.35: 2 -0.65,2.91; 3 0,2.91; 4 0.65,2.91 | smd 0.22 x 1.35: 6 -1.21,2.91; 7 1.21,2.91 | smd 1.8 x 1.9: D_0 -1.15,0.11; D_1 1.15,0.11 | drill 1 pad 1.8 square: G -4.175,0.11; G2 4.175,0.11 | drill 1 pad 1.2 offset: G3 -2.225,3.235; G4 2.225,3.235
53048-05 = drill 0.5 pad 0.698 long: 1 2.5,-1.25; 2 1.25,-1.25; 3 0,-1.25; 4 -1.25,-1.25; 5 -2.5,-1.25
X2-SMD-5.0X3.2X1.3MM = smd 1.778 x 2.032: 1 -2.159,0; 2 2.159,0

### Placement (x,y rotation side)
BOOT  40.32,84.77 270 bottom
C1  21.91,60.96 0 bottom
C2  14.29,60.96 180 bottom
C3  14.29,41.91 0 bottom
C4  6.67,41.91 180 bottom
C5  40.96,70.48 180 top
C6  63.82,73.03 0 top
C7  40.32,77.47 90 top
C8  53.02,85.72 0 top
C9  54.93,62.87 180 top
C10  48.89,62.87 270 top
C11  46.99,62.87 270 top
C12  46.67,59.37 270 top
C13  62.55,70.17 0 top
C14  56.2,84.14 0 top
C15  25.43,98.47 180 bottom
C16  1.19,97.3 90 bottom
C17  7.52,93.38 180 bottom
C18  58,43.95 90 top
C19  4.2,98.8 0 bottom
C20  6.66,86.95 90 bottom
C21  17.34,86.97 90 bottom
C22  40.32,65.72 315 top
C23  42.86,63.18 135 top
C24  21.89,86.98 90 bottom
C25  49.05,35.8 90 top
C26  -3.3,-10.55 0 top  (outside the outline)
C100  65.72,36.2 180 top
C101  64.45,48.9 270 top
C102  61.91,36.2 180 top
C110  40.64,94.3 90 top
C111  41.27,89.53 90 top
C112  40.64,98.11 90 top
C120  11.11,71.75 270 bottom
C121  9.21,76.2 270 bottom
C122  2.86,76.2 270 bottom
C301  48.58,16.83 180 top
C302  48.58,32.07 0 top
C303  42.23,16.83 180 top
C304  41.27,22.23 270 top
C401  56.52,53.34 315 top
C402  59.05,50.8 135 top
C403  46.99,54.61 270 top
C404  46.99,50.8 90 top
C405  49.53,50.8 90 top
C406  49.53,54.61 270 top
C407  45.09,38.1 270 top
C408  47.05,38.12 270 top
C409  41.27,48.26 270 top
C410  43.81,41.91 270 top
C411  51.44,38.42 270 top
C412  57.15,39.37 90 top
C413  42.86,32.07 180 top
C414  41.27,26.67 90 top
C501  56.2,20.32 270 top
C502  56.2,31.75 270 top
C503  58.74,27.94 270 top
C504  66.36,24.13 90 top
C601  40.32,11.43 270 top
C602  44.13,8.89 0 top
C603  40.32,1.27 0 top
C604  44.13,1.27 180 top
C605  51.75,8.89 0 top
C606  47.94,1.27 0 top
C607  63.18,3.81 180 top
C608  55.56,8.89 180 top
C609  55.56,1.27 180 top
C610  51.75,1.27 0 top
C901  66.67,78.29 270 top
CN1  63.82,96.52 270 bottom
CVA  7.94,31.11 270 top
CVB  20.64,31.11 90 top
D1  55.56,56.83 90 top
D2  55.56,60.01 90 top
D3  60.33,46.35 90 top
D4  4.3,93.09 270 bottom
D120  15.56,76.83 0 bottom
ENC1  18.1,66.67 0 top
ENC2  10.48,47.62 0 top
IC3  46.04,24.45 90 top
IC4  50.16,45.09 180 top
IC5  62.55,26.04 0 top
IC6  49.85,5.71 270 top
IC7  6.03,64.77 180 bottom
IC9  64.77,85.09 180 top
IC100  63.82,41.91 0 top
IC110  46.35,96.2 270 top
INL  7.94,18.41 270 top
INR  7.94,5.71 270 top
JP1  6.67,12.06 0 top
JP2  45.4,12.06 0 top
JP4  45.4,91.44 0 top
JP5  6.67,91.44 0 top
JP8  61.91,59.05 0 top
JP9  65.72,70.48 270 top
JP10  26.99,70.48 270 top
JP11  1.59,57.78 270 top
JP12  40.32,57.78 270 top
OUTL  20.64,18.41 90 top
OUTR  20.64,5.71 90 top
R1  59.05,83.19 270 top
R2  61.28,83.19 270 top
R3  40.32,81.28 270 top
R4  40.01,38.1 90 top
R5  7.2,98.8 180 bottom
R6  10.2,98.8 180 bottom
R121  6.03,71.75 270 bottom
R122  0.95,71.75 90 bottom
R300  40.01,41.91 90 top
R301  52.39,19.37 180 top
R302  52.39,21.91 180 top
R303  48.58,19.37 180 top
R304  55.56,24.13 270 top
R305  52.39,24.45 0 top
R306  52.39,32.07 180 top
R307  52.39,29.53 180 top
R308  48.58,29.53 180 top
R309  55.56,27.94 90 top
R310  52.39,26.99 0 top
R401  42.55,38.1 270 top
R402  44.45,54.61 270 top
R501  58.74,20.32 90 top
R502  61.28,20.32 90 top
R503  58.74,24.13 90 top
R504  63.82,20.32 90 top
R505  66.36,20.32 270 top
R506  61.28,31.75 270 top
R507  63.82,31.75 270 top
R508  58.74,31.75 90 top
R509  66.36,31.75 270 top
R510  66.36,27.94 270 top
R601  42.86,11.43 90 top
R602  40.32,8.89 180 top
R603  44.13,6.35 180 top
R604  47.94,8.89 180 top
R605  40.32,6.35 180 top
R606  44.13,3.81 180 top
R607  40.32,3.81 0 top
R608  59.37,6.35 180 top
R609  63.18,6.35 0 top
R610  56.2,6.35 0 top
R611  59.37,8.89 180 top
R612  59.37,3.81 0 top
R613  55.56,3.81 0 top
R614  59.37,1.27 0 top
R901  66.04,92.08 270 top
U1  51.75,74.3 45 top
U$1  14.29,96.69 180 top
USB1  56.2,98.74 180 top
X2  50.16,79.38 0 bottom
Y1  55.88,50.16 135 top
Y2  43.5,66.36 135 top

### Tracks (layer width: path | path; a pad name or v marks a point on that pad's centre or on a via)
+3V3  (via drill 0.3)
  Top 0.203: v40.01,86.04 40.01,89.99 C111.+
  Top 0.254: U1.100 40.95,76.62 C7.1 | C5.1 41.59,70.48 | U1.11 44.95,68.9 43.68,68.9 42.99,69.6 42.99,70.48 U1.6 | C8.1 52.17,84.8 U1.75 | U1.21 47.93,64.83 v47.56,64.83 47.56,65.87 U1.19 | 42.56,74.3 42.64,74.3 | 61.91,73.03 61.5,73.03 U1.50 | U1.21 | U1.21 U1.22 | U1.28 55.78,63.19 C9.1
  Top 0.406: C112.1 41.7,96.2 IC110.2 44.45,96.2 45.4,95.25 | R300.2 40.01,42.86 41.59,44.45 46.67,44.45 48.54,46.32 IC4.10 48.54,49.25 47.84,49.95 C404.1 46.57,49.95 45.72,50.8 45.72,54.19 C403.1 46.99,56.52 47.94,57.47 47.94,57.78 v48.58,58.42 | C12.1 46.46,60.22 45.72,60.96 45.72,62.87 46.35,63.5 46.46,63.5 C11.1 46.99,64.26 v47.56,64.83 48.58,63.82 C10.1 49.31,63.72 51.12,61.91 55.24,61.91 | D1.2 57.78,57.78 58.42,58.42 58.42,60.33 57.78,60.96 D2.2 56.2,60.96 55.24,61.91 | C8.1 52.07,85.72 51.75,86.04 46.99,86.04 v46.67,85.72 | v66.67,85.72 IC9.8 C901.1 65.72,78.19 65.72,76.2 62.97,73.44 C6.1 61.91,73.03 61.15,73.79 60.64,73.79 60.33,73.66 53.76,73.66 51.3,76.11 v47.63,76.11 44.38,76.11 42.56,74.3 40.96,74.3 | v66.04,93.98 R901.1 | C111.+ 41.45,91.44 JP4.1 45.4,95.25 | 45.4,95.25 46.35,96.2 IC110.4 | 40.96,74.3 40.32,73.66 40.32,72.39 41.81,70.91 C5.1 42.99,70.48 | C9.1 55.78,62.45 55.24,61.91 | C7.1 40.32,74.93 40.96,74.3
  Bottom 0.203: v40.01,86.04 40.01,85.54 BOOT.1
  Bottom 0.406: v66.67,85.72 66.67,93.34 v66.04,93.98 | JP4.1 46.67,90.17 v46.67,85.72 46.67,79.12 X2.1 47.66,76.25 v47.63,76.11 47.63,71.75 48.26,71.12 48.26,65.74 arc-51 48,65.19 v47.56,64.83 48.58,63.82 v48.58,58.42
+5V
  Top 0.406: 62.87,36.2 C102.1 63.82,37.25 IC100.2 IC100.4 | 63.21,44.45 IC100.4 | 63.21,44.45 63.21,44.42 | C101.+ 64.45,45.7 IC100.4 | 63.21,44.45 61.94,45.82 55.98,45.82 54.61,44.45 50.48,44.45 49.19,43.16 IC4.20 49.19,39.75 48.41,38.97 C408.1 47.03,38.95 C407.1 44.55,38.95 42.96,37.37 42.52,37.35 42.52,37.25 R401.2
+12V  (via drill 0.3)
  Top 0.406: C503.1 58.89,28.64 IC5.8 60.64,27.3 61.28,26.67 v62.55,26.67 | IC6.8 51.75,7.62 | 51.75,7.62 v49.85,7.62 | v49.85,24.13 49.53,24.45 IC3.4 | C605.1 50.9,8.47 51.75,7.62 | v49.85,18.1 54.93,18.1 56.2,16.83 62.55,16.83 v62.87,17.14 | JP8.1 56.83,64.14 v56.52,64.45
  Top 0.813: JP9.4 65.09,62.87 63.82,64.14 JP8.2 JP8.1
  Bottom 0.356: v49.85,7.62 49.21,8.26 49.21,17.14 49.85,17.78 v49.85,18.1
  Bottom 0.406: v49.85,24.13 v49.85,18.1 | v62.87,17.14 62.55,17.46 v62.55,26.67 62.55,34.61 61.28,35.88 61.28,50.16 56.2,55.24 56.2,64.14 v56.52,64.45
-12V  (via drill 0.3)
  Top 0.406: C504.1 66.2,23.43 IC5.4 64.45,24.77 v63.82,25.4 | 47.25,1.43 C606.1 47.09,1.49 v46.04,2.54 47.25,3.75 IC6.4 | IC3.11 44.45,24.45 v44.77,24.13 | v44.45,15.24 46.67,15.24 47.31,15.88 52.7,15.88 53.34,16.51 55.24,16.51 55.56,16.19 v63.82,16.19 | D3.A 60.33,43.5 v62.87,40.96
  Bottom 0.406: v44.77,24.13 44.45,23.81 v44.45,15.24 43.5,14.29 43.5,5.08 v46.04,2.54 | v63.82,16.19 v63.82,25.4 63.82,40.01 v62.87,40.96
ADC0  (via drill 0.3)
  Top 0.254: C301.1 51.75,16.83 v52.07,17.14 | v53.02,60.33 53.02,58.42 54.46,56.98 D1.3 53.66,56.03 v53.66,53.98 | v51.75,66.99 51.53,66.99 U1.23
  Top 0.406: C301.1 49.43,16.93 47.73,18.63 R303.2
  Bottom 0.254: v52.07,17.14 52.07,26.35 52.39,26.67 52.39,35.24 51.44,36.2 51.44,51.75 v53.66,53.98 | v53.02,60.33 51.75,61.59 51.75,65.14 arc45 51.57,65.59 arc-45 51.44,65.91 51.44,66.54 arc-45 51.53,66.77 v51.75,66.99
ADC1  (via drill 0.3)
  Top 0.254: D2.3 54.29,60.18 v54.29,60.96 53.98,61.28 51.12,61.28 49.85,60.01 49.85,58.42 48.26,56.83 v48.26,56.2 | v52.39,66.04 51.29,66.04 U1.24
  Top 0.406: R308.2 C302.1 47.73,32.8 v47.94,33.02 | 54.29,59.84 D2.3
  Bottom 0.254: v47.94,33.02 47.94,55.88 v48.26,56.2 | v52.39,66.04 52.39,62.87 v54.29,60.96
ADCREF  (via drill 0.3)
  Top 0.406: IC3.14 IC3.13 44.77,21.91 v46.67,23.81 | v50.48,33.02 53.98,33.02 v54.61,32.38 | R309.1 55.56,26.67 v54.93,26.04 55.56,25.4 R304.1
  Bottom 0.406: v46.67,23.81 49.85,26.99 49.85,32.38 v50.48,33.02 | v54.61,32.38 53.98,31.75 53.98,29.53 54.93,28.57 v54.93,26.04
AINA  (via drill 0.3)
  Top 0.406: v60.33,25.4 59.16,25.4 R503.2 58.32,24.98 57.47,24.13 57.47,22.44 C501.1 | IC4.17 47.24,43.11 49.85,45.72 53.34,45.72 54.61,46.99 56.43,46.99 v56.5,47.02
  Bottom 0.406: v60.33,25.4 60.01,25.72 60.01,36.2 58.1,38.1 58.1,45.42 v56.5,47.02
AINB  (via drill 0.3)
  Top 0.406: R508.2 C502.1 55.98,32.6 v54.61,33.97 | IC4.18 47.89,42.81 50.16,45.09 53.98,45.09 v54.93,46.04
  Bottom 0.406: v54.61,33.97 54.93,34.29 v54.93,46.04
ANALOG_OUTA
  Top 0.406: R604.2 47.09,7.78 IC6.1 46.25,7.62 C602.2 44.98,9.63 44.03,10.58 R601.1
ANALOG_OUTB
  Top 0.406: IC6.7 53.66,6.35 54.71,7.41 C608.2 54.71,9.31 55.56,10.16 57.25,10.16 R611.2 58.52,8.47 60.22,6.77 R608.1
AOUTA+  (via drill 0.3)
  Top 0.406: R605.2 39.47,7.52 v39.37,7.62 | v41.91,33.66 42.86,34.61 47.51,34.61 47.85,34.95 C25.1 53.05,34.95 v53.98,35.88 | IC4.25 52.44,41.22 53.02,40.64 v53.98,40.64
  Bottom 0.406: v39.37,7.62 39.37,8.57 41.27,10.48 41.27,33.02 v41.91,33.66 | v53.98,35.88 v53.98,40.64
AOUTA-  (via drill 0.3)
  Top 0.406: v39.37,14.92 39.16,14.71 39.16,9.21 R602.2 | v40.01,34.92 41.59,34.92 42.06,35.39 47.04,35.39 48.2,36.55 48.75,36.55 C25.2 arc90 48.99,36.51 v53.02,36.51 | IC4.24 51.79,40.92 v53.02,39.69
  Bottom 0.406: v39.37,14.92 39.05,15.24 39.05,33.97 v40.01,34.92 | v53.02,36.51 v53.02,39.69
AOUTB+  (via drill 0.3)
  Top 0.406: IC4.26 53.09,42.93 53.98,43.81 55.24,43.81 v56.2,44.77 57.96,44.77 arc90 C18.2 | v61.28,2.54 61.28,2.75 R612.2
  Bottom 0.356: 59.37,13.34 59.37,4.45
  Bottom 0.406: v56.2,44.77 56.2,38.1 58.74,35.56 58.74,13.97 59.37,13.34 | 59.37,4.45 v61.28,2.54
AOUTB-  (via drill 0.3)
  Top 0.406: IC4.27 53.74,42.63 54.29,43.18 55.56,43.18 56.2,43.16 v57.15,43.16 57.93,43.16 arc-90 C18.1 | v60.01,13.97 60.33,13.65 61.28,13.65 64.14,10.79 64.14,6.45 R609.2
  Bottom 0.406: v60.01,13.97 59.37,14.61 59.37,35.88 57.15,38.1 v57.15,43.16
BOOT  (via drill 0.3)
  Top 0.203: v41.27,84.14 41.27,81.06 40.64,80.43 R3.2
  Top 0.254: U1.94 42.12,79.69 41.06,79.69 R3.2
  Bottom 0.203: BOOT.2 41.09,84.32 v41.27,84.14
CS_CS  (via drill 0.3)
  Top 0.254: IC4.13 46.59,47.54 46.35,47.31 44.77,47.31 v44.45,46.99 | v46.04,77.47 46.35,77.79 46.35,78.29 U1.90
  Bottom 0.254: v44.45,46.99 44.77,47.31 44.77,75.94 arc-45 44.95,76.39 v46.04,77.47
CS_LRCK  (via drill 0.3)
  Top 0.254: IC4.4 52.44,59.32 v52.07,59.69 | v50.48,74.3 49.85,73.66 44.04,73.66 U1.3
  Bottom 0.254: v52.07,59.69 51.12,60.64 51.12,64.96 arc45 51.02,65.18 51.01,65.2 arc-45 50.8,65.7 50.8,71.66 arc-45 51.09,72.37 51.3,72.58 arc45 51.44,72.89 arc63 50.63,74.22 v50.48,74.3
CS_RST  (via drill 0.3)
  Top 0.254: v42.86,53.98 44.24,53.98 R402.2 | v44.45,80.01 44.45,79.48 U1.91
  Top 0.406: R402.2 44.45,48.9 45.16,48.19 IC4.14
  Bottom 0.254: v44.45,80.01 44.45,76.97 arc-45 44.36,76.74 44.23,76.61 arc45 44.13,76.39 44.13,55.24 v42.86,53.98
CS_SCL  (via drill 0.3)
  Top 0.254: IC4.11 47.89,46.62 46.99,45.72 v45.72,45.72 | v46.99,70.17 54.65,70.17 57.53,73.05 59.36,73.05 U1.47
  Bottom 0.254: v45.72,45.72 45.4,46.04 45.4,68.9 46.67,70.17 v46.99,70.17
CS_SCLK  (via drill 0.3)
  Top 0.254: IC4.5 51.79,58.7 v50.8,59.69 | v50.48,73.03 44.12,73.03 U1.4
  Bottom 0.254: v50.8,59.69 50.48,60.01 50.48,64.51 arc45 50.3,64.96 arc-45 50.16,65.27 50.16,72.26 arc-45 v50.48,73.03
CS_SDA  (via drill 0.3)
  Top 0.254: IC4.12 47.24,47.24 v46.51,46.51 | v46.35,66.36 47.34,66.36 U1.18
  Bottom 0.254: v46.35,66.36 46.04,66.04 46.04,46.99 v46.51,46.51
CS_SDIN  (via drill 0.3)
  Top 0.254: IC4.7 50.48,56.2 50.48,57.15 v50.16,57.47 | v48.58,72.07 48.26,72.39 44.21,72.39 U1.5
  Bottom 0.254: v50.16,57.47 50.16,57.78 49.21,58.74 49.21,63.87 arc45 49.03,64.32 arc-45 48.89,64.64 48.89,71.31 arc45 v48.58,72.07
CS_SDOUT  (via drill 0.3)
  Top 0.254: IC4.6 51.14,58.08 v50.8,58.42 | U1.2 43.96,74.3 48.89,74.3 v49.21,74.61
  Bottom 0.254: v50.8,58.42 49.85,59.37 49.85,64.32 arc45 49.75,64.55 49.74,64.56 arc-45 49.53,65.06 49.53,73.85 arc45 v49.21,74.61
CS_VQ1  (via drill 0.3)
  Top 0.406: IC3.10 41.38,25.72 C414.1 40.54,25.82 39.69,26.67 39.69,31.09 C413.+ 39.05,33.68 39.05,44.31 C409.+ 42.41,45.4 v43.18,45.4 | C410.1 43.92,42.86 v44.77,42.86 45.06,42.86 IC4.15
  Bottom 0.406: v44.77,42.86 43.18,44.45 v43.18,45.4
CS_VREF  (via drill 0.3)
  Top 0.406: IC3.9 IC3.8 44.45,28.26 46.35,30.16 46.35,33.34 v46.34,33.66 46.6,33.87 53.24,33.87 54.29,34.92 v57.47,34.92 64.45,34.92 66.36,33.02 R509.1 | C501.2 56.2,19.05 v57.47,17.78 57.78,17.46 61.91,17.46 63.82,19.37 R504.1 | C502.2 57.05,30.9 v57.47,30.48 | IC4.19 48.54,41.24 47.94,40.64 v46.99,40.64 46.59,41.04 IC4.16
  Bottom 0.406: v57.47,17.78 58.1,18.41 58.1,29.84 v57.47,30.48 v57.47,34.92 | v46.99,40.64 46.99,40.32 46.35,39.69 46.35,33.97 v46.34,33.66
CVA  (via drill 0.3)
  Top 0.406: JP2.1 47.94,14.61 v50.8,14.61 | v53.66,20.95 53.66,21.49 R302.1
  Bottom 0.406: v50.8,14.61 53.66,17.46 v53.66,20.95
CVB  (via drill 0.3)
  Top 0.406: JP2.2 49.53,13.65 51.44,13.65 52.39,14.61 v54.93,14.61 | v54.93,30.16 53.87,30.16 R307.1
  Bottom 0.406: v54.93,14.61 55.24,14.92 55.24,17.78 56.83,19.37 56.83,25.72 55.56,26.99 55.56,29.53 v54.93,30.16
ENC_A  (via drill 0.3)
  Top 0.254: JP9.5 60.01,60.33 58.42,61.91 v58.42,62.87 | v56.83,77.47 56.83,78.42 56.52,78.74 56.52,79.06 U1.63
  Bottom 0.254: v58.42,62.87 58.64,63.09 arc45 58.74,63.31 58.75,63.32 58.75,67.05 56.83,68.97 v56.83,77.47
ENC_B  (via drill 0.3)
  Top 0.254: JP9.6 60.01,57.78 59.06,58.74 59.06,60.64 v57.47,62.23 | v55.88,78.11 55.88,79.14 U1.64
  Bottom 0.254: v57.47,62.23 57.47,63.05 arc-45 57.56,63.27 58.01,63.73 arc45 58.1,63.95 58.1,66.75 56.2,68.65 56.2,76.57 arc45 56.01,77.02 arc-45 55.88,77.34 v55.88,78.11
FLASH_HOLD
  Top 0.204: IC9.7 65.41,78.91 64.55,78.05 61.15,78.05 U1.55
FLASH_MISO  (via drill 0.3)
  Top 0.204: v60.5,78.65 64.05,78.65 v64.75,79.35
  Top 0.254: IC9.2 65.41,87.63 v64.77,87 | U1.44 58.74,71.55 v57.5,71.55
  Bottom 0.204: 60.5,72.25 v60.5,78.65 | v64.77,87 64.77,79.4 v64.75,79.35
  Bottom 0.254: v57.5,71.55 59.8,71.55 60.5,72.25
FLASH_MOSI  (via drill 0.3)
  Top 0.204: 62.85,80.8 62.9,80.75 | 62.9,80.75 62.9,81.31 IC9.5 | v59.9,79.35 62.5,79.35 62.9,79.75 62.9,80.75
  Top 0.254: U1.45 58.65,72.35 v58.15,72.35
  Bottom 0.204: v58.15,72.35 59.55,72.35 59.9,72.7 v59.9,79.35
FLASH_NCS
  Top 0.254: IC9.1 66.67,87 65.72,86.04 62.55,86.04 61.91,86.68 45.09,86.68 43.5,85.09 43.5,79.69 43.83,79.38 U1.92
  Top 0.406: IC9.1 66.67,90.59 R901.2
FLASH_SCK  (via drill 0.3)
  Top 0.204: U1.1 44.38,75.4 51.1,75.4 53.6,72.9 v55.5,72.9
  Top 0.254: 42.01,73.03 U1.1 | IC9.6 64.14,80.01 v63.7,79.59 | v63.5,66.99 63.18,67.31 58.16,67.31 v57.3,66.45
  Bottom 0.204: v55.5,72.9 55.5,68.25 v57.3,66.45
  Bottom 0.254: v63.7,79.59 63.72,78.96 63.72,67.26 v63.5,66.99
FLASH_W
  Top 0.254: IC9.3 64.14,87.95 63.5,87.31 44.86,87.31 43,85.45 43,79.53 U1.93
GND  (via drill 0.3)  (75 unrouted)
  Top 0.203: USB1.5 54.9,96.24 USB1.7
  Top 0.254: U1.74 54.29,84.63 v54.29,85.09 53.87,85.51 C8.2 | USB1.5 54.81,96.34 USB1.G4 | U1.10 46.35,71.02 v46.35,71.12 | C7.2 41.06,78.32 v41.27,78.11 41.27,76.98 U1.99 | C503.2 59.91,27.09 v61.59,25.4 62.55,25.4 63.5,26.35 v64.77,26.35 | 50.8,68.26 50.68,68.26 U1.20 | v53.34,63.18 53.66,62.87 C9.2 53.98,62.97 53.98,64.28 U1.27
  Top 0.406: C100.2 64.77,36.2 64.77,36.83 v65.09,37.15 | 61.06,38.3 IC100.1 | IC110.1 42.75,98.96 C112.2 39.9,98.96 v39.69,98.74 | R305.2 53.24,25.5 v53.02,25.72 | R310.2 53.24,25.93 v53.02,25.72 | C403.2 v46.99,52.7 C404.2 | C406.2 v49.53,52.7 C405.2 | IC4.21 49.84,40.33 v50.16,40.01 | C604.2 C603.2 41.17,2.33 v40.96,2.54 41.17,2.75 R607.2 | C609.2 v53.66,1.27 C610.2 | R614.2 v61.28,1.27 | C414.2 41.27,28.26 v42.23,29.21 | C302.2 49.43,31.33 v48.89,30.8 | C605.2 52.6,9.74 v53.02,10.16 | C607.1 64.03,2.75 v63.82,2.54 | R505.2 v66.36,18.73 | C504.2 v66.36,26.04 R510.2 | v57.15,27.94 58,27.09 58.52,27.09 58.74,27.3 | IC4.8 49.84,47.31 v50.48,46.67 v52.7,46.67 | C304.2 41.27,21.27 v40.32,20.32 | C413.- 44.13,32.07 v44.13,31.11 | 50.06,37.57 v50.12,37.77 | C412.- 56.22,36.85 v55.88,36.83 55.14,37.57 C411.2 50.27,37.57 v50.12,37.77 | v60.33,37.15 61.59,38.68 IC100.1 | C101.- v63.5,50.48 | C402.2 v57.78,52.07 | v57.78,52.07 | v57.78,52.07 C401.2 | C23.2 v41.59,64.45 C22.2 | v45.09,36.3 C407.2 45.1,37.27 C408.2 47.62,37.27 48.11,37.77 v50.12,37.77 | C410.2 44.66,41.06 v45.4,40.32 | C10.2 47.73,62.02 v47.63,61.91 47.52,62.02 C11.2 | C5.2 v40.01,71.44 | C901.2 v66.67,76.39 | v57.46,55.88 v57.47,55.88 58.1,56.52 v58.42,56.52 JP8.7 | D2.1 56.84,59.06 v57.47,59.69 | C110.2 39.9,95.15 v39.69,94.93 | R4.1 v40.01,36.2 | C14.2 57.05,84.67 56.95,84.77 v56.83,84.77 | v43.18,57.78 v46.99,57.78 46.99,58.2 C12.2 | 56.2,59.06 v55.24,58.1 | R402.1 43.28,55.46 v43.18,55.56 | C409.- 41.27,51.75 JP12.3 | D1.1 55.88,55.88 v55.24,55.24 | v44.45,84.77 v47.63,84.77 | v41.27,86.36 C111.- | C601.1 v40.32,13.34 40.96,13.97 v42.55,13.97 v45.09,13.97 | IC9.4 62.49,89.22 v62.23,89.22 61.28,89.22 60.96,88.9 v57.47,88.9 57.15,89.22 55.88,89.22 55.24,88.58 v53.34,88.58 50.48,88.58 v50.16,88.27 v44.45,88.27
  Top 0.406: v46.35,71.12 51.76,71.12 | 50.8,68.26 v54.61,68.26 | v53.98,15.56 56.52,15.56 56.83,15.24 v57.15,15.24 57.47,15.24 57.78,15.56 62.55,15.56 v62.87,15.24 | R3.1 v40.32,83.19 | v49.53,1.27 C606.2 | v53.02,25.72 v51.12,25.72 | v40.32,19.37 v42.86,19.37 v45.4,19.37 | C301.2 v46.99,16.83 | C303.- v45.4,16.83 | v62.23,74.93 63.18,74.93 v64.77,76.52 | v63.82,83.5 v65.72,83.5 | C6.2 64.77,72.92 64.77,71.44 JP9.1 65.41,70.17 C13.2 | v60.33,37.15 57.15,37.15 56.83,37.47 | C102.2 61.28,36.2 v60.33,37.15 | IC100.1 61.52,38.18 v62.23,37.47 | v60.33,46.99 v62.23,46.99
  Bottom 0.406: 61.91,62.87 61.91,55.24
  other vias: 51.75,68.26 51.75,71.12 47.62,88.27
  pour Bottom: 35.88,100.33 70.17,100.33 70.17,-0.64 35.88,-0.64
INL  (via drill 0.3)
  Top 0.406: JP2.3 51.12,12.06 52.7,13.65 57.15,13.65 58.42,14.92 61.28,14.92 v61.59,14.61 | R502.1 v61.28,18.41
  Bottom 0.406: v61.28,18.41 61.59,18.1 v61.59,14.61
INR  (via drill 0.3)
  Top 0.406: v56.2,33.97 63.18,33.97 63.82,33.34 R507.1
  Bottom 0.406: JP2.5 55.88,12.38 55.88,17.46 57.47,19.05 57.47,26.04 56.2,27.3 v56.2,33.97
MID_GND
  pour Bottom: -3.49,36.83 -3.49,-0.64 32.07,-0.64 32.07,36.83
N$1
  Top 0.406: C603.1 R607.1 39.47,4.23 41.17,5.93 R605.1 43.28,4.24 R606.2
N$2
  Top 0.406: IC3.3 50.27,23.18 R305.1 52.7,23.28 R304.2
N$3
  Bottom 0.813: IC7.3 9.78,69.57 C120.2 12.17,70.91 13.41,72.14 D120.C
N$4
  Top 0.406: IC3.2 R302.2 51.54,21.49 53.24,19.79 R301.1
N$5
  Top 0.406: R301.2 R303.1 49.43,19.85 IC3.1
N$7
  Top 0.406: 60.89,48.51 D3.C
  Top 0.61: 60.89,48.51 61.91,49.53 61.91,52.7 | JP8.9 61.91,52.7 | JP8.10 61.91,52.7
N$9  (via drill 0.3)
  Top 0.254: v24.45,96.75 U$1.P$3 | U$1.P$32 v4.14,96.51 v4.15,96.5
  Bottom 0.254: v4.15,96.5 4.6,96.05 11.65,96.05 12.35,96.75 v24.45,96.75 24.45,98.06 C15.+
N$10
  Top 0.406: R601.2 42.44,12.28 40.74,10.58 C601.2 41.17,9.73 R602.1 41.17,8.68 43.28,6.57 R603.2
N$11
  Top 0.254: C13.1 61.7,72.14 U1.49
N$12
  Top 0.254: U1.13 44.71,67.25 44.71,65.15 Y2.1
  Top 0.406: Y2.1 45.02,64.14 C23.1
N$13
  Top 0.406: IC6.2 R603.1 44.98,6.77 43.28,8.47 C602.1
N$14
  Top 0.406: C604.1 R606.1 46.25,5.08 IC6.3
N$15
  Top 0.254: Y2.2 42.23,67.63 42.29,67.57 44.31,67.57 U1.12
  Top 0.406: Y2.2 41.28,67.88 C22.1
N$16
  Bottom 0.813: R122.2 0.99,72.61 C122.+ 4.73,72.61 | R121.1 4.73,72.61 | IC7.1 3.75,71.63 4.73,72.61
N$17
  Top 0.254: U1.73 54.52,84.14 C14.1
N$18
  Top 0.406: C402.1 58.1,48.64 Y1.1 56.95,48.19 IC4.1
N$19  (via drill 0.3)
  Top 0.203: USB1.3 56.2,93.66 v55.88,93.34 | v55.88,85.72 56.2,86.04 57.47,86.04 59.06,84.45 R1.1
  Bottom 0.203: v55.88,93.34 55.56,93.34 54.29,92.08 54.29,90.81 54.93,90.17 54.93,86.68 v55.88,85.72
N$20
  Top 0.406: IC4.22 50.49,41.05 51.44,40.1 C411.1 51.65,39.05 52.07,39.05 52.49,38.63 54.21,38.63 C412.+
N$21
  Top 0.406: IC4.2 53.74,51.08 Y1.2 54.35,52.38 C401.1
N$22  (via drill 0.3)
  Top 0.203: USB1.2 56.85,92.72 v56.83,92.71 | v59.06,85.72 59.59,85.72 R2.1
  Bottom 0.203: v56.83,92.71 56.83,90.81 58.74,88.9 58.74,86.04 v59.06,85.72
N$23  (via drill 0.3)
  Top 0.305: U$1.P$5 23.04,94.66 24.15,93.55 24.15,89.8 v23.15,88.8
  Bottom 0.305: v23.15,88.8 21.91,88.8 C24.+
  Bottom 0.406: C21.- C24.+
N$25
  Top 0.406: R614.1 C609.1 R613.2 R612.1
N$26
  Top 0.406: R610.2 R608.2 58.52,5.93 59.37,5.08 61.28,5.08 | R609.1 62.33,6.13 61.28,5.08 | C607.2 62.33,4.03 61.28,5.08
N$27
  Top 0.406: C608.1 56.41,7.83 55.35,6.77 R610.1 54.08,5.08 IC6.6
N$28
  Top 0.406: R613.1 IC6.5 50.9,2.27 C610.1
N$29  (via drill 0.3)
  Top 0.254: U$1.P$28 U$1.P$29 U$1.P$30 v5.54,94.86 v5.55,94.85
  Bottom 0.254: v5.55,94.85 4.36,94.85 D4.C
N$30  (via drill 0.3)
  Top 0.254: v9.1,97.25 9.1,98.77 U$1.P$25
  Bottom 0.254: R6.1 9.1,98.55 v9.1,97.25
N$31  (via drill 0.3)
  Top 0.254: U$1.P$24 9.74,97.51 10.05,97.2 v11.05,97.2
  Bottom 0.254: v11.05,97.2 R6.2
N$32  (via drill 0.3)
  Top 0.254: v8.3,97.25 8.3,98.79 U$1.P$26
  Bottom 0.254: R5.2 8.3,98.55 v8.3,97.25
N$36
  Top 0.406: R505.1 R504.2 63.18,21.8 IC5.3
N$38
  Top 0.406: R501.1 59.16,19.47 60.86,21.17 R502.2 61.91,21.8 IC5.2
N$40
  Top 0.406: 60.64,23.5 IC5.1 60.64,23.07 R501.2 R503.1
N$42
  Top 0.406: IC5.5 64.45,29 R509.2 R510.1
N$43
  Top 0.406: IC5.6 63.18,30.27 R507.2 63.4,30.9 61.7,32.6 R506.1
N$45
  Top 0.406: IC5.7 61.91,30.27 R506.2 R508.1
N$48  (via drill 0.3)
  Top 0.406: C303.+ 39.05,18.75 39.05,21.59 v40.01,22.54 40.54,23.07 C304.1 41.38,23.18 IC3.12 | R300.1 R4.2 40.11,38.95 41.27,37.78 v41.27,36.2
  Bottom 0.406: v40.01,22.54 39.69,22.86 39.69,33.34 41.27,34.92 v41.27,36.2
N$49
  Top 0.406: IC3.5 49.63,25.72 50.9,26.99 R310.1 51.54,27.41 52.39,28.26 54.29,28.26 54.83,28.79 R309.2
N$50
  Top 0.406: IC3.6 49.85,26.99 51.54,28.68 R307.2 51.54,29.95 53.24,31.65 R306.1
N$52
  Top 0.406: IC3.7 49.43,29.05 R308.1 49.43,29.74 51.54,31.85 R306.2
NRST  (via drill 0.3)  (1 unrouted)
  Top 0.203: v52.39,69.22 47.39,69.22 U1.14
  Bottom 0.203: X2.5 52.66,76.42 arc-45 52.48,75.97 arc45 52.39,75.75 52.39,75.54 arc45 52.6,75.04 52.69,74.95 arc-45 53.02,74.14 53.02,70.64 arc-45 52.46,69.29 v52.39,69.22
OLED_CS  (via drill 0.3)
  Top 0.254: v49.53,85.09 49.53,84.31 U1.77
  Bottom 0.254: JP4.3 50.48,90.17 49.21,88.9 49.21,85.41 v49.53,85.09
OLED_DC  (via drill 0.3)
  Top 0.254: JP4.5 54.29,90.17 v49.21,90.17 | v48.58,84.45 48.67,84.45 U1.78
  Bottom 0.254: v49.21,90.17 48.58,89.53 v48.58,84.45
OLED_MOSI  (via drill 0.3)
  Top 0.254: v61.91,66.36 60.96,65.41 56.4,65.41 U1.32
  Bottom 0.254: JP4.7 60.64,87.31 61.28,86.68 61.28,83.82 60.33,82.87 60.33,80.02 61.2,79.15 61.2,67.07 v61.91,66.36
OLED_RST  (via drill 0.3)
  Top 0.254: v53.66,67.31 53.78,67.31 U1.31
  Bottom 0.254: JP4.4 53.02,91.12 51.75,89.85 51.75,83.45 arc45 51.94,83 54.11,80.83 arc-45 54.29,80.38 54.29,75.64 arc-45 54.01,74.97 53.94,74.89 arc45 53.66,74.22 v53.66,67.31
OLED_SCK  (via drill 0.3)
  Top 0.254: JP4.6 56.83,90.17 55.24,90.17 54.61,89.53 49.85,89.53 49.53,89.22 v45.4,89.22 | v45.4,81.28 45.4,79.93 U1.89
  Bottom 0.254: v45.4,89.22 v45.4,81.28
OUTL
  Top 0.406: JP2.4 51.12,10.16 50.06,10.16 R604.1
OUTR
  Top 0.406: R611.1 60.22,9.95 JP2.6
SW1
  Top 0.254: JP9.2 65.09,68.58 59.59,68.58 U1.41
SW2  (via drill 0.3)
  Top 0.254: v42.55,77.79 42.62,77.79 U1.96 | JP12.1 40.64,57.78 v43.18,60.33
  Bottom 0.254: v42.55,77.79 43.31,77.02 arc-45 43.5,76.57 43.5,60.64 v43.18,60.33
SWCLK
  Top 0.203: U1.76 51.12,83.41 51.12,80.76 49.02,78.66 arc45 48.91,78.41 X2.2
SWDIO
  Top 0.203: U1.72 53.34,82.24 53.34,82.23 52.39,81.28 52.39,79.72 51.41,78.75 X2.4
SWENC_A
  Top 0.254: JP9.3 65.72,66.04 63.82,67.94 59.5,67.94 U1.40
SWENC_B  (via drill 0.3)
  Top 0.254: v59.37,55.24 JP9.7 | v60.01,69.53 59.35,69.53 U1.42
  Bottom 0.254: v60.01,69.53 59.47,68.99 arc45 59.37,68.77 v59.37,55.24
TOP_+3V3  (via drill 0.3)
  Top 0.254: U$1.P$8 U$1.P$7 U$1.P$6
  Top 0.305: U$1.P$8 U$1.P$7 21.65,95.05 23.4,93.3 23.4,90.5 21.65,88.75 v18.5,88.75 v16.2,88.75 9.36,88.75 JP5.1
  Bottom 0.254: 6.67,93.28 C17.1
  Bottom 0.305: JP5.1 6.67,93.28 | C21.+ 18.48,88.77 arc-90 v18.5,88.75 | v16.2,88.75 16.8,88.75
  Bottom 0.406: C20.+ JP5.1
TOP_+12V  (via drill 0.3)
  Top 0.254: U$1.P$31 v4.85,97.2 | U$1.P$4 23.74,97.39 v23.75,97.35
  Bottom 0.254: C19.1 4.85,98.6 v4.85,97.2 | v4.85,97.2 3.85,97.2 2.95,96.3 1.59,96.3 C16.+ | v4.85,97.2 5.5,96.55 11.4,96.55 12.2,97.35 v23.75,97.35
  Bottom 0.406: D120.A 17.76,81.29 16.55,82.5 2.95,82.5 1.19,84.26 C16.+
  Bottom 0.813: JP10.4 23.18,62.87 17.71,68.33 D120.A
TOP_CVA
  Top 0.406: JP1.1 6.67,12.7 10.48,16.51 10.48,20.64 12.86,23.02 CVA.P$3
TOP_CVB
  Top 0.406: JP1.2 9.21,13.65 11.43,15.88 11.43,20 15.72,24.29 CVB.P$3
TOP_ENC_A  (via drill 0.3)
  Top 0.406: v23.18,50.8 16.83,44.45 12.3,44.45 ENC2.PINA
  Bottom 0.406: ENC2.PINA 7.98,41.45 C4.2 | JP10.5 23.81,57.15 23.81,51.44 v23.18,50.8
TOP_ENC_B  (via drill 0.3)
  Top 0.406: v25.08,50.16 15.56,40.64 13.49,40.64 ENC2.PINB
  Bottom 0.406: ENC2.PINB 12.98,41.45 C3.2 | JP10.6 25.08,55.88 v25.08,50.16
TOP_GND  (via drill 0.3)
  Top 0.254: U$1.P$16 U$1.P$17 U$1.P$18 U$1.P$19 U$1.P$20 U$1.P$21 U$1.P$22 U$1.P$23 | U$1.P$11 U$1.P$10 | U$1.P$2 U$1.P$1
  Top 0.813: 20.64,73.66 23.81,73.66 JP10.1
  other vias: 0.95,69.85 12.38,74.93 6.03,74.93 19.15,95.8 20.6,85.75 20.55,84.75 8.6,85.7 8.55,84.55 10.5,89.65 13.15,89.65 12.85,95.75 14.55,95.8 19.15,94.05 21.35,94.05 22.35,95.85 20.9,95.8 6.15,97.2 7.15,97.2 2.5,97
  pour Bottom (rank 2): -3.49,100.33 -3.49,37.47 32.07,37.47 32.07,100.33
  pour Top (rank 2): -3.49,101.6 -3.49,37.47 32.07,37.47 32.07,101.6
TOP_INL
  Top 0.406: INR.P$2 4.56,6.78 6.67,8.89 8.57,8.89 JP1.3 12.86,13.18 INL.P$3
TOP_INR
  Top 0.406: JP1.5 16.83,9.69 INR.P$3
TOP_OLED_CS
  Top 0.254: U$1.P$12 18.14,90.64 17.45,89.95 16.2,89.95 15.55,90.6 15.55,92.15 14.85,92.85 13.16,92.85 JP5.3
TOP_OLED_DC
  Top 0.254: U$1.P$13 17.44,92.34 16.8,91.7 16.8,91.47 JP5.5
TOP_OLED_MOSI  (via drill 0.3)
  Top 0.254: U$1.P$15 16.04,96.31 v16,94.1
  Bottom 0.254: v16,94.1 17.75,94.1 18.9,92.95 20.5,92.95 JP5.7
TOP_OLED_RST
  Top 0.254: JP5.4 14.29,90.26 15.1,89.45 19.85,89.45 20.65,90.25 20.65,92.1 20.2,92.55 20.2,98.65 U$1.P$9
TOP_OLED_SCK  (via drill 0.3)
  Top 0.254: v16.75,93.3 U$1.P$14
  Bottom 0.254: v16.75,93.3 17.55,93.3 18.37,92.43 JP5.6
TOP_OUTL
  Top 0.406: OUTL.P$3 15.72,13.49 JP1.4
TOP_OUTR
  Top 0.406: JP1.6 19.37,9.37 OUTR.P$3
TOP_SW1
  Top 0.406: JP10.2 25.72,69.22 20.06,69.22 ENC1.SWITCH1
TOP_SW2
  Bottom 0.406: JP11.1 2.22,57.78 5.4,54.61 7.96,54.61 ENC2.SWITCH1
TOP_SWENC_A
  Top 0.406: JP10.3 26.35,65.41 25.08,64.14 19.68,64.14 15.56,60.33 15.56,59.22 ENC1.PINA
  Bottom 0.406: ENC1.PINA 15.6,60.5 C2.2
TOP_SWENC_B
  Top 0.406: JP10.7 24.53,55.24 ENC1.PINB
  Bottom 0.406: ENC1.PINB 20.6,60.5 C1.2
TOP_VCC  (via drill 0.3)
  Top 0.813: JP11.2 4.76,55.24 7.3,52.7 JP10.8
  Bottom 0.813: v6.03,62.23 IC7.4 | v6.03,64.77 R121.2 6.45,70.91 9.21,73.66 C121.+
  other vias: 3.49,59.69 4.76,64.77 4.13,64.14 4.76,63.5 3.49,63.5 4.13,62.87 3.49,62.23 4.13,61.59 3.49,60.96 4.13,60.33 4.76,60.96 4.76,62.23 5.4,62.87 5.4,61.59 5.4,64.14 6.03,63.5 6.67,64.14 7.3,64.77 7.94,64.14 8.57,64.77 8.57,63.5 7.3,63.5 6.67,62.87 7.94,62.87 8.57,62.23 7.3,62.23 6.67,61.59 7.94,61.59 8.57,60.96 7.3,60.96 6.03,60.96 5.4,60.33 4.76,59.69 6.03,59.69 6.67,60.33 7.94,60.33 7.3,59.69 8.57,59.69 3.49,64.77
  pour Top: -0.32,69.22 12.38,69.22 12.38,55.24 -0.32,55.24
  pour Bottom: -0.32,69.22 12.38,69.22 12.38,55.24 -0.32,55.24
UART_RX  (via drill 0.3)
  Top 0.254: v61.91,88.27 61.59,87.95 56.83,87.95 v56.52,88.27 | 55.2,81.87 U1.69 56.09,82.87 57.15,82.87 v57.47,82.55
  Bottom 0.254: v61.91,88.27 62.55,88.27 63.82,89.53 CN1.1 | v56.52,88.27 57.78,87 57.78,82.87 v57.47,82.55
UART_TX  (via drill 0.3)
  Top 0.254: v59.06,89.85 60.96,89.85 62.23,91.12 62.23,96.84 62.23,96.93 CN1.3 | U1.68 55.85,81.92 55.88,81.92 56.2,82.23 56.52,82.23 57.47,81.28 v58.1,81.28
  Bottom 0.254: v59.06,89.85 59.37,89.53 59.37,86.68 60.01,86.04 60.01,84.45 59.06,83.5 59.06,82.23 v58.1,81.28
USB_DM  (via drill 0.3)
  Top 0.254: R2.2 61.3,82.06 v61.3,81.33 | v62.87,75.88 61.91,76.83 61.37,76.83 U1.53
  Bottom 0.204: v61.3,81.33 61.3,79.95 61.75,79.5 61.75,77 v62.87,75.88
USB_DP  (via drill 0.3)
  Top 0.254: U1.54 59.7,75.88 59.06,75.88 v58.42,76.52 | v58.74,80.33 59.06,80.64 R1.2
  Bottom 0.254: v58.42,76.52 58.42,79.88 arc-45 58.51,80.1 v58.74,80.33
USB_ID  (via drill 0.3)
  Top 0.203: USB1.4 55.55,93.97 54.29,92.71 v51.75,92.71 | v53.34,75.56 54.61,74.3 60.23,74.3 U1.51
  Bottom 0.203: v51.75,92.71 51.75,90.81 51.12,90.17 51.12,83 arc45 51.21,82.78 53.56,80.42 arc-45 53.66,80.2 53.66,75.88 v53.34,75.56
USB_VBUS  (via drill 0.3)
  Top 0.203: USB1.1 57.5,96.24 USB1.6 57.41,93.41 58.1,92.71 v59.37,92.71 | v58.74,75.25 60.5,75.25 U1.52
  Bottom 0.203: v59.37,92.71 59.37,90.81 60.01,90.17 60.01,87 60.64,86.36 60.64,84.14 59.69,83.19
  Bottom 0.204: 59.69,83.19 59.69,80.14 59.2,79.65 59.2,75.71 v58.74,75.25
VCC  (via drill 0.3)  (1 unrouted)
  Top 0.406: C100.1 66.57,38.3 IC100.3 66.12,40.4 v66.36,40.64 | IC110.3 42.75,93.45 C110.1 40.42,93.45 v39.37,92.39
  Bottom 0.406: v66.36,40.64 66.36,52.07 JP9.8 | v39.37,92.39 39.05,92.08 39.05,61.59 41.91,58.74 41.91,56.83 JP12.2
VD
  Top 0.406: C406.1 48.26,54.19 48.26,51.22 C405.1 49.19,49.61 IC4.9 49.19,46.02 46.99,43.81 43.18,43.81 42.55,43.18 R401.1

### Text on the board
tPlace: Rebel Technology | Prism Rev03 | Prism Rev02
bPlace: Rebel Technology | Prism Rev02